# EasyEDA Pro project ProPrj_[LiThermal]热成像相机.epro, schematic V1.2_S1

## Sheets
1 SOC: Board Name: V1.2; Create Date: 2024-09-09; Page Name: SOC; Project Name: [LiThermal] 热成像相机; Schematic Name: V1.2_S1; Update Date: 2024-09-09
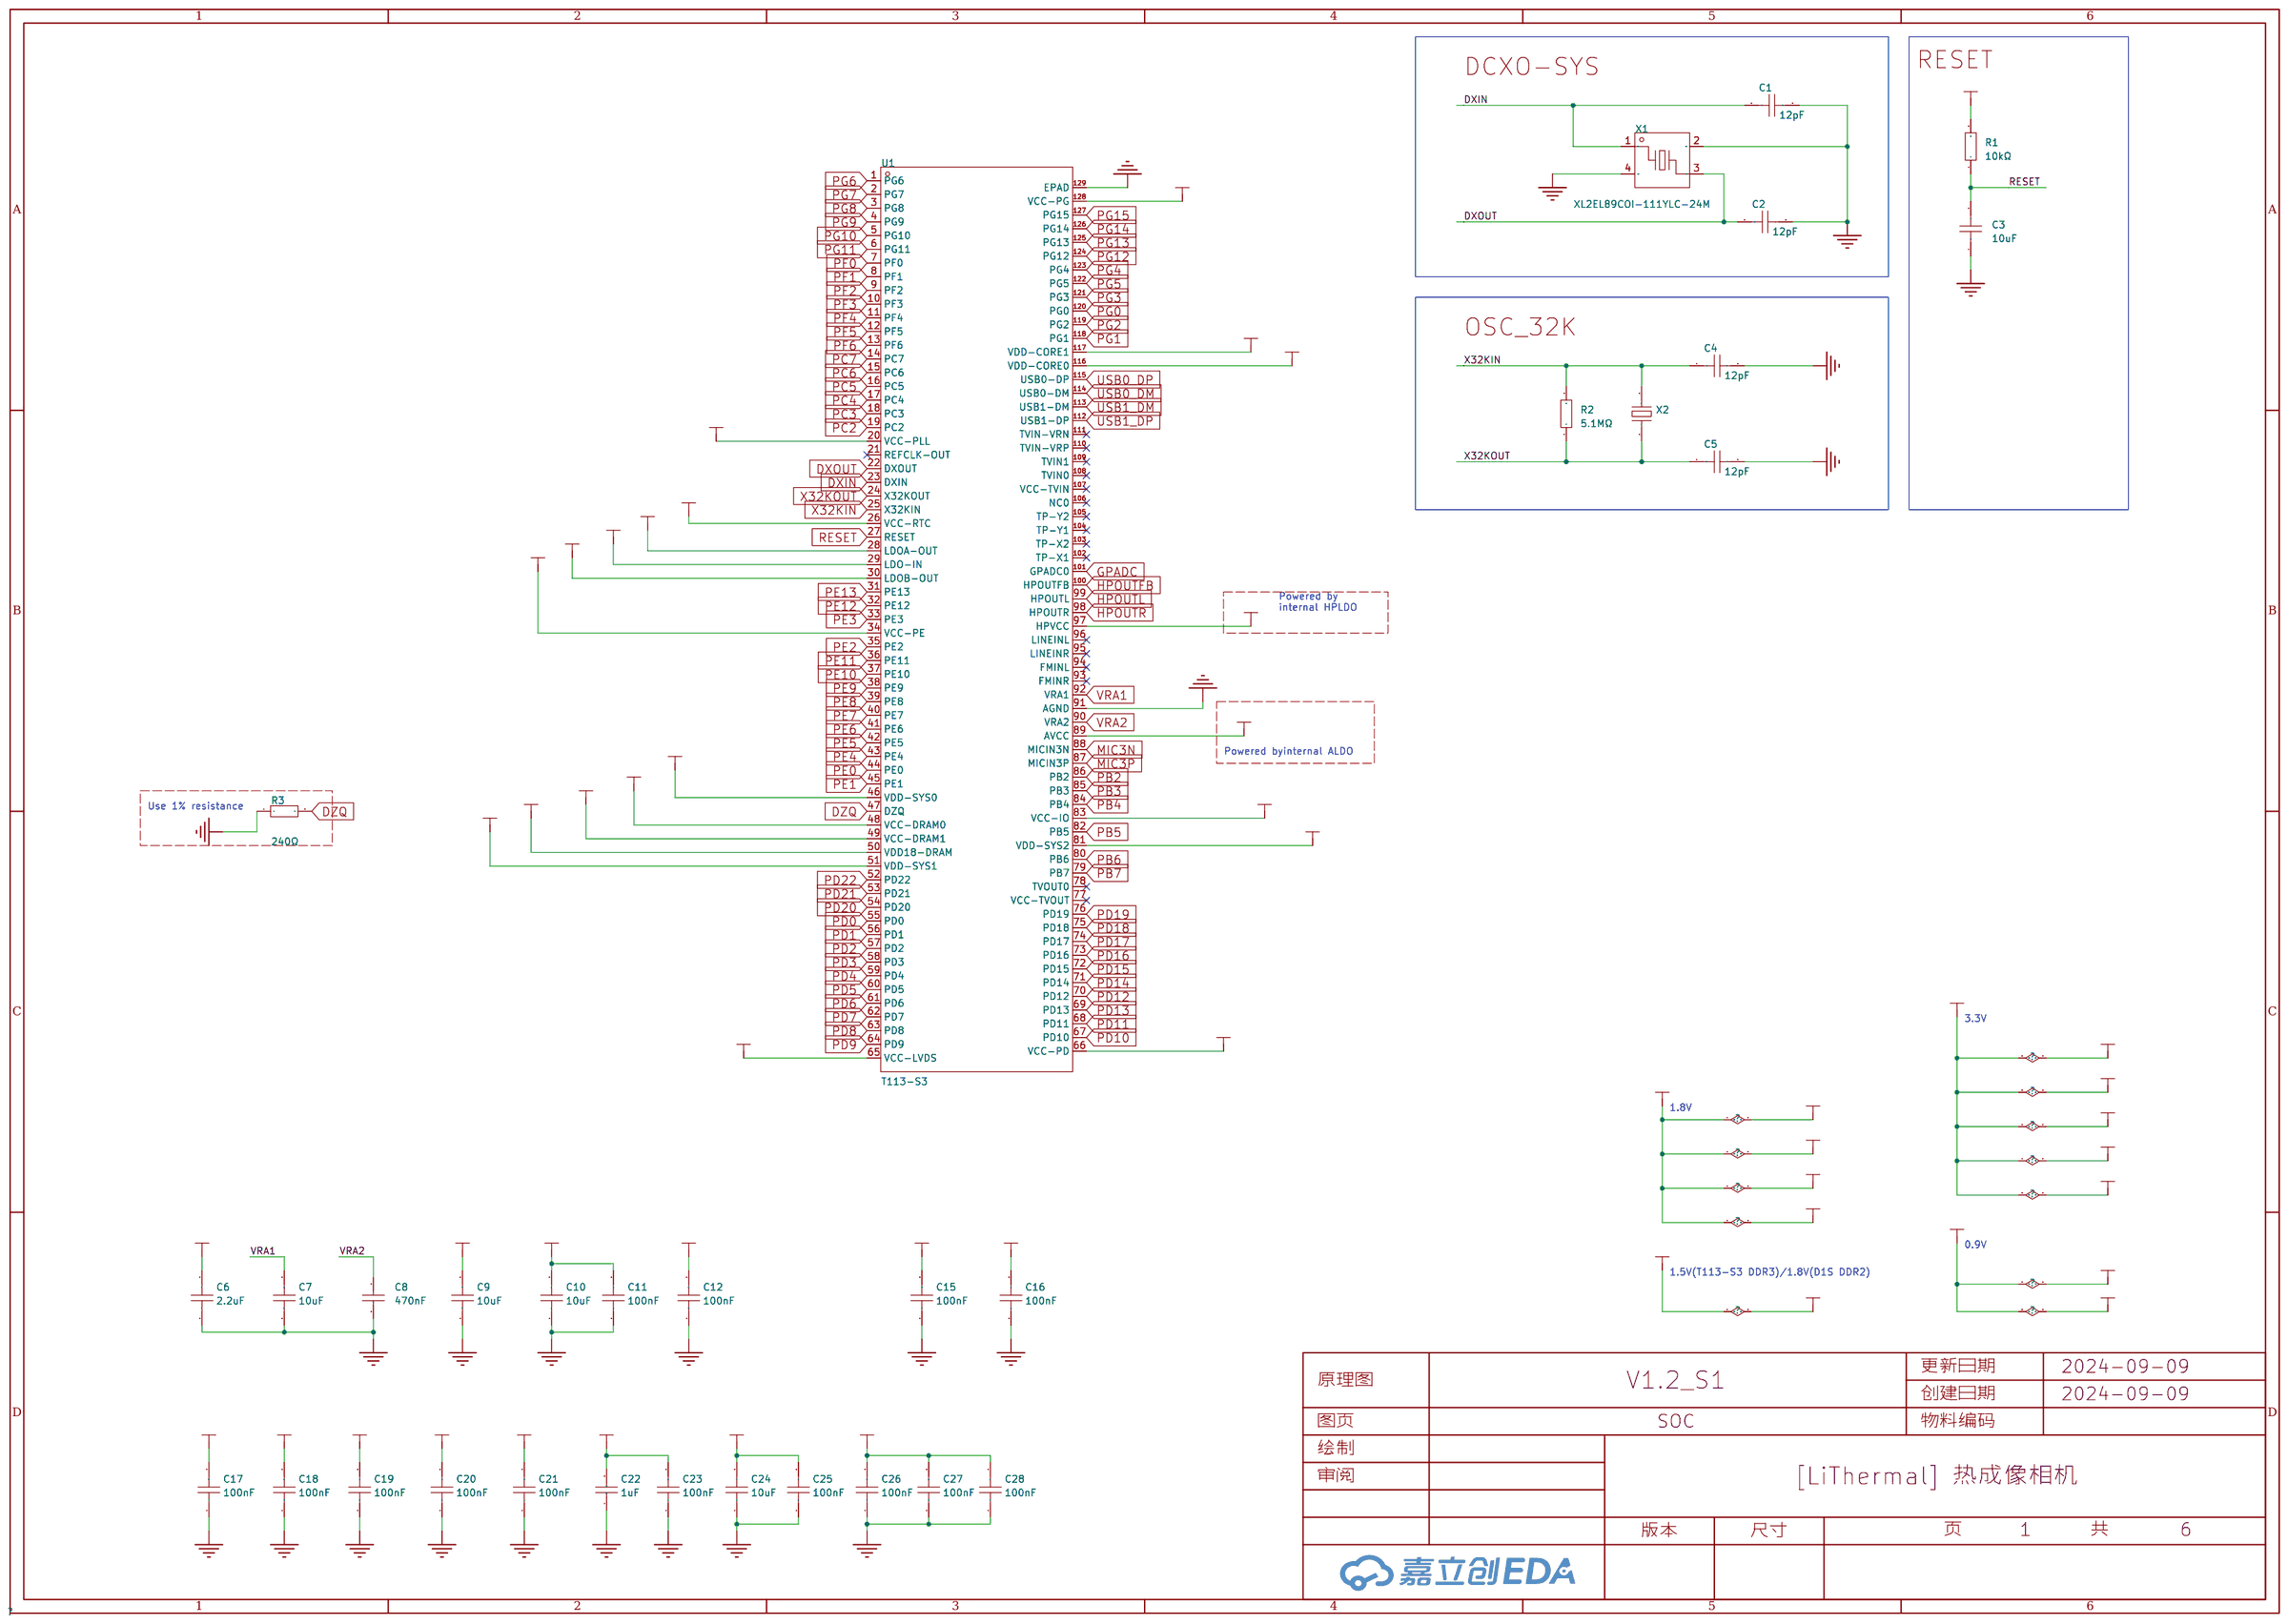
[diagram p0: SOC]
2 Power: Create Date: 2024-08-21; Page Name: Power; Project Name: 全志T113-S3测试板; Update Date: 2024-08-23
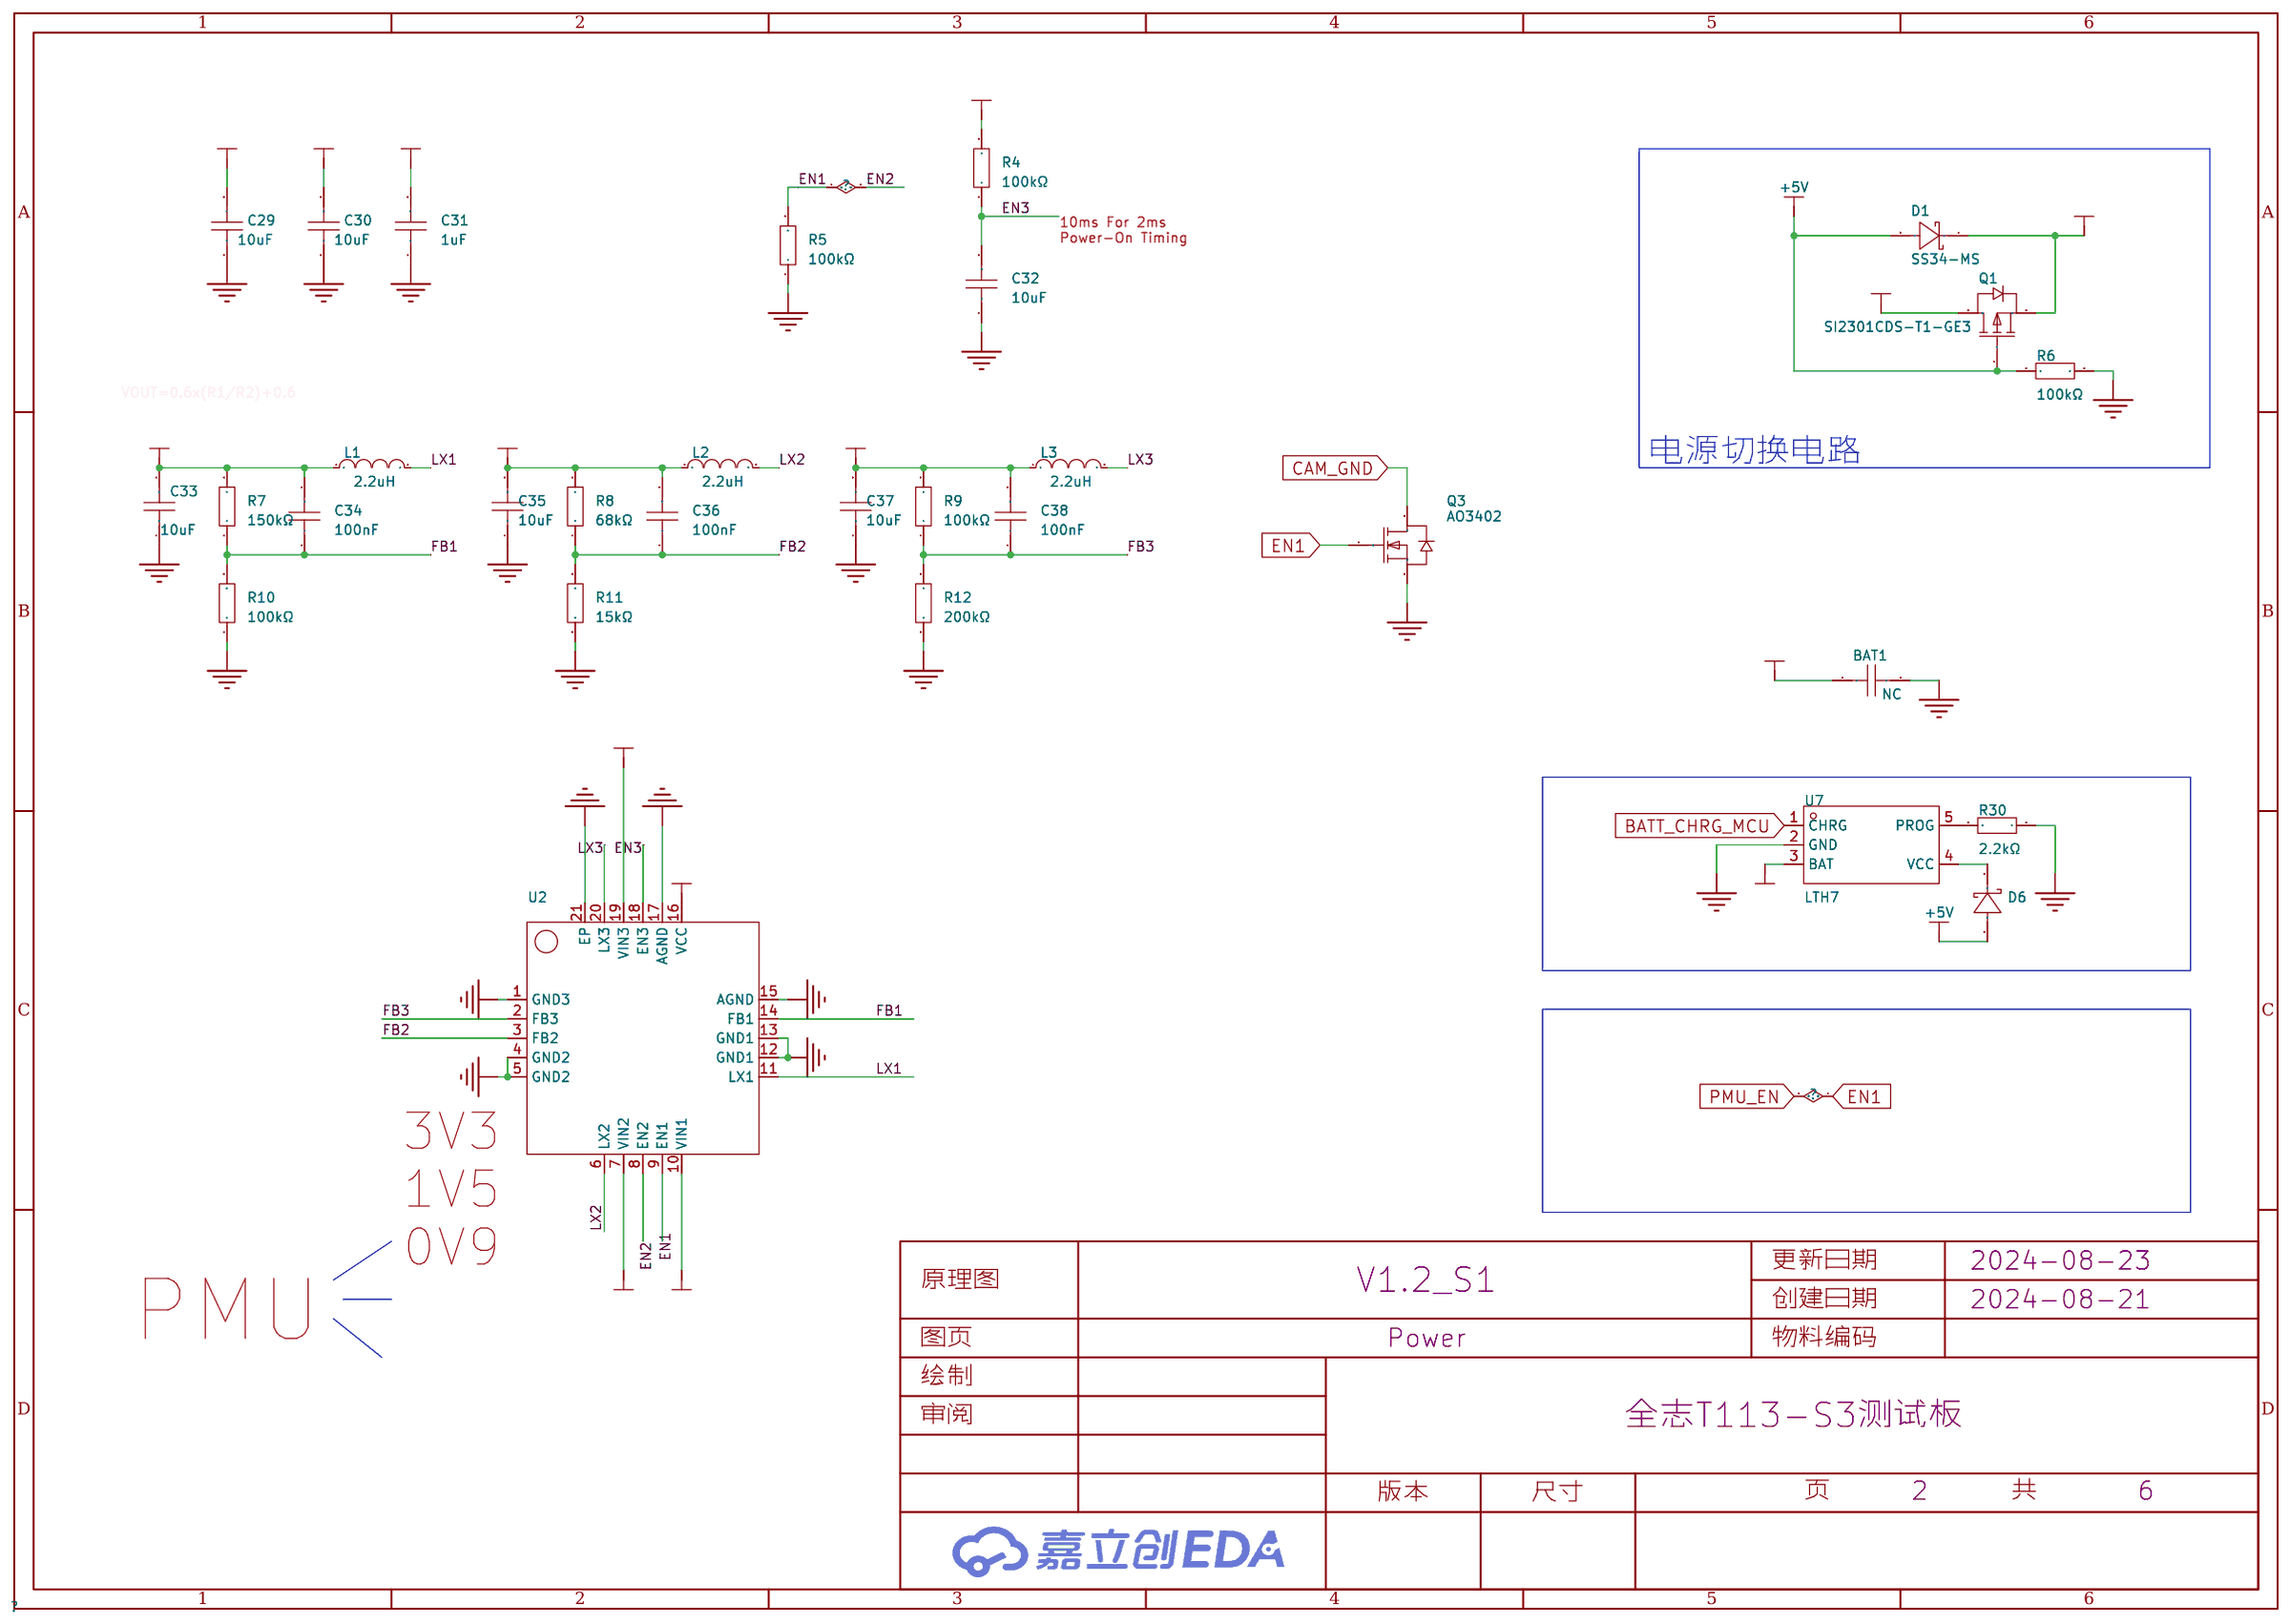
[diagram p1: Power]
3 LCD: Create Date: 2024-06-05; Page Name: LCD; Project Name: 全志T113-S3测试板; Schematic Name: Schematic5; Update Date: 2024-06-06; Company: 嘉立创EDA; Page Size: A4; Version: V1.0
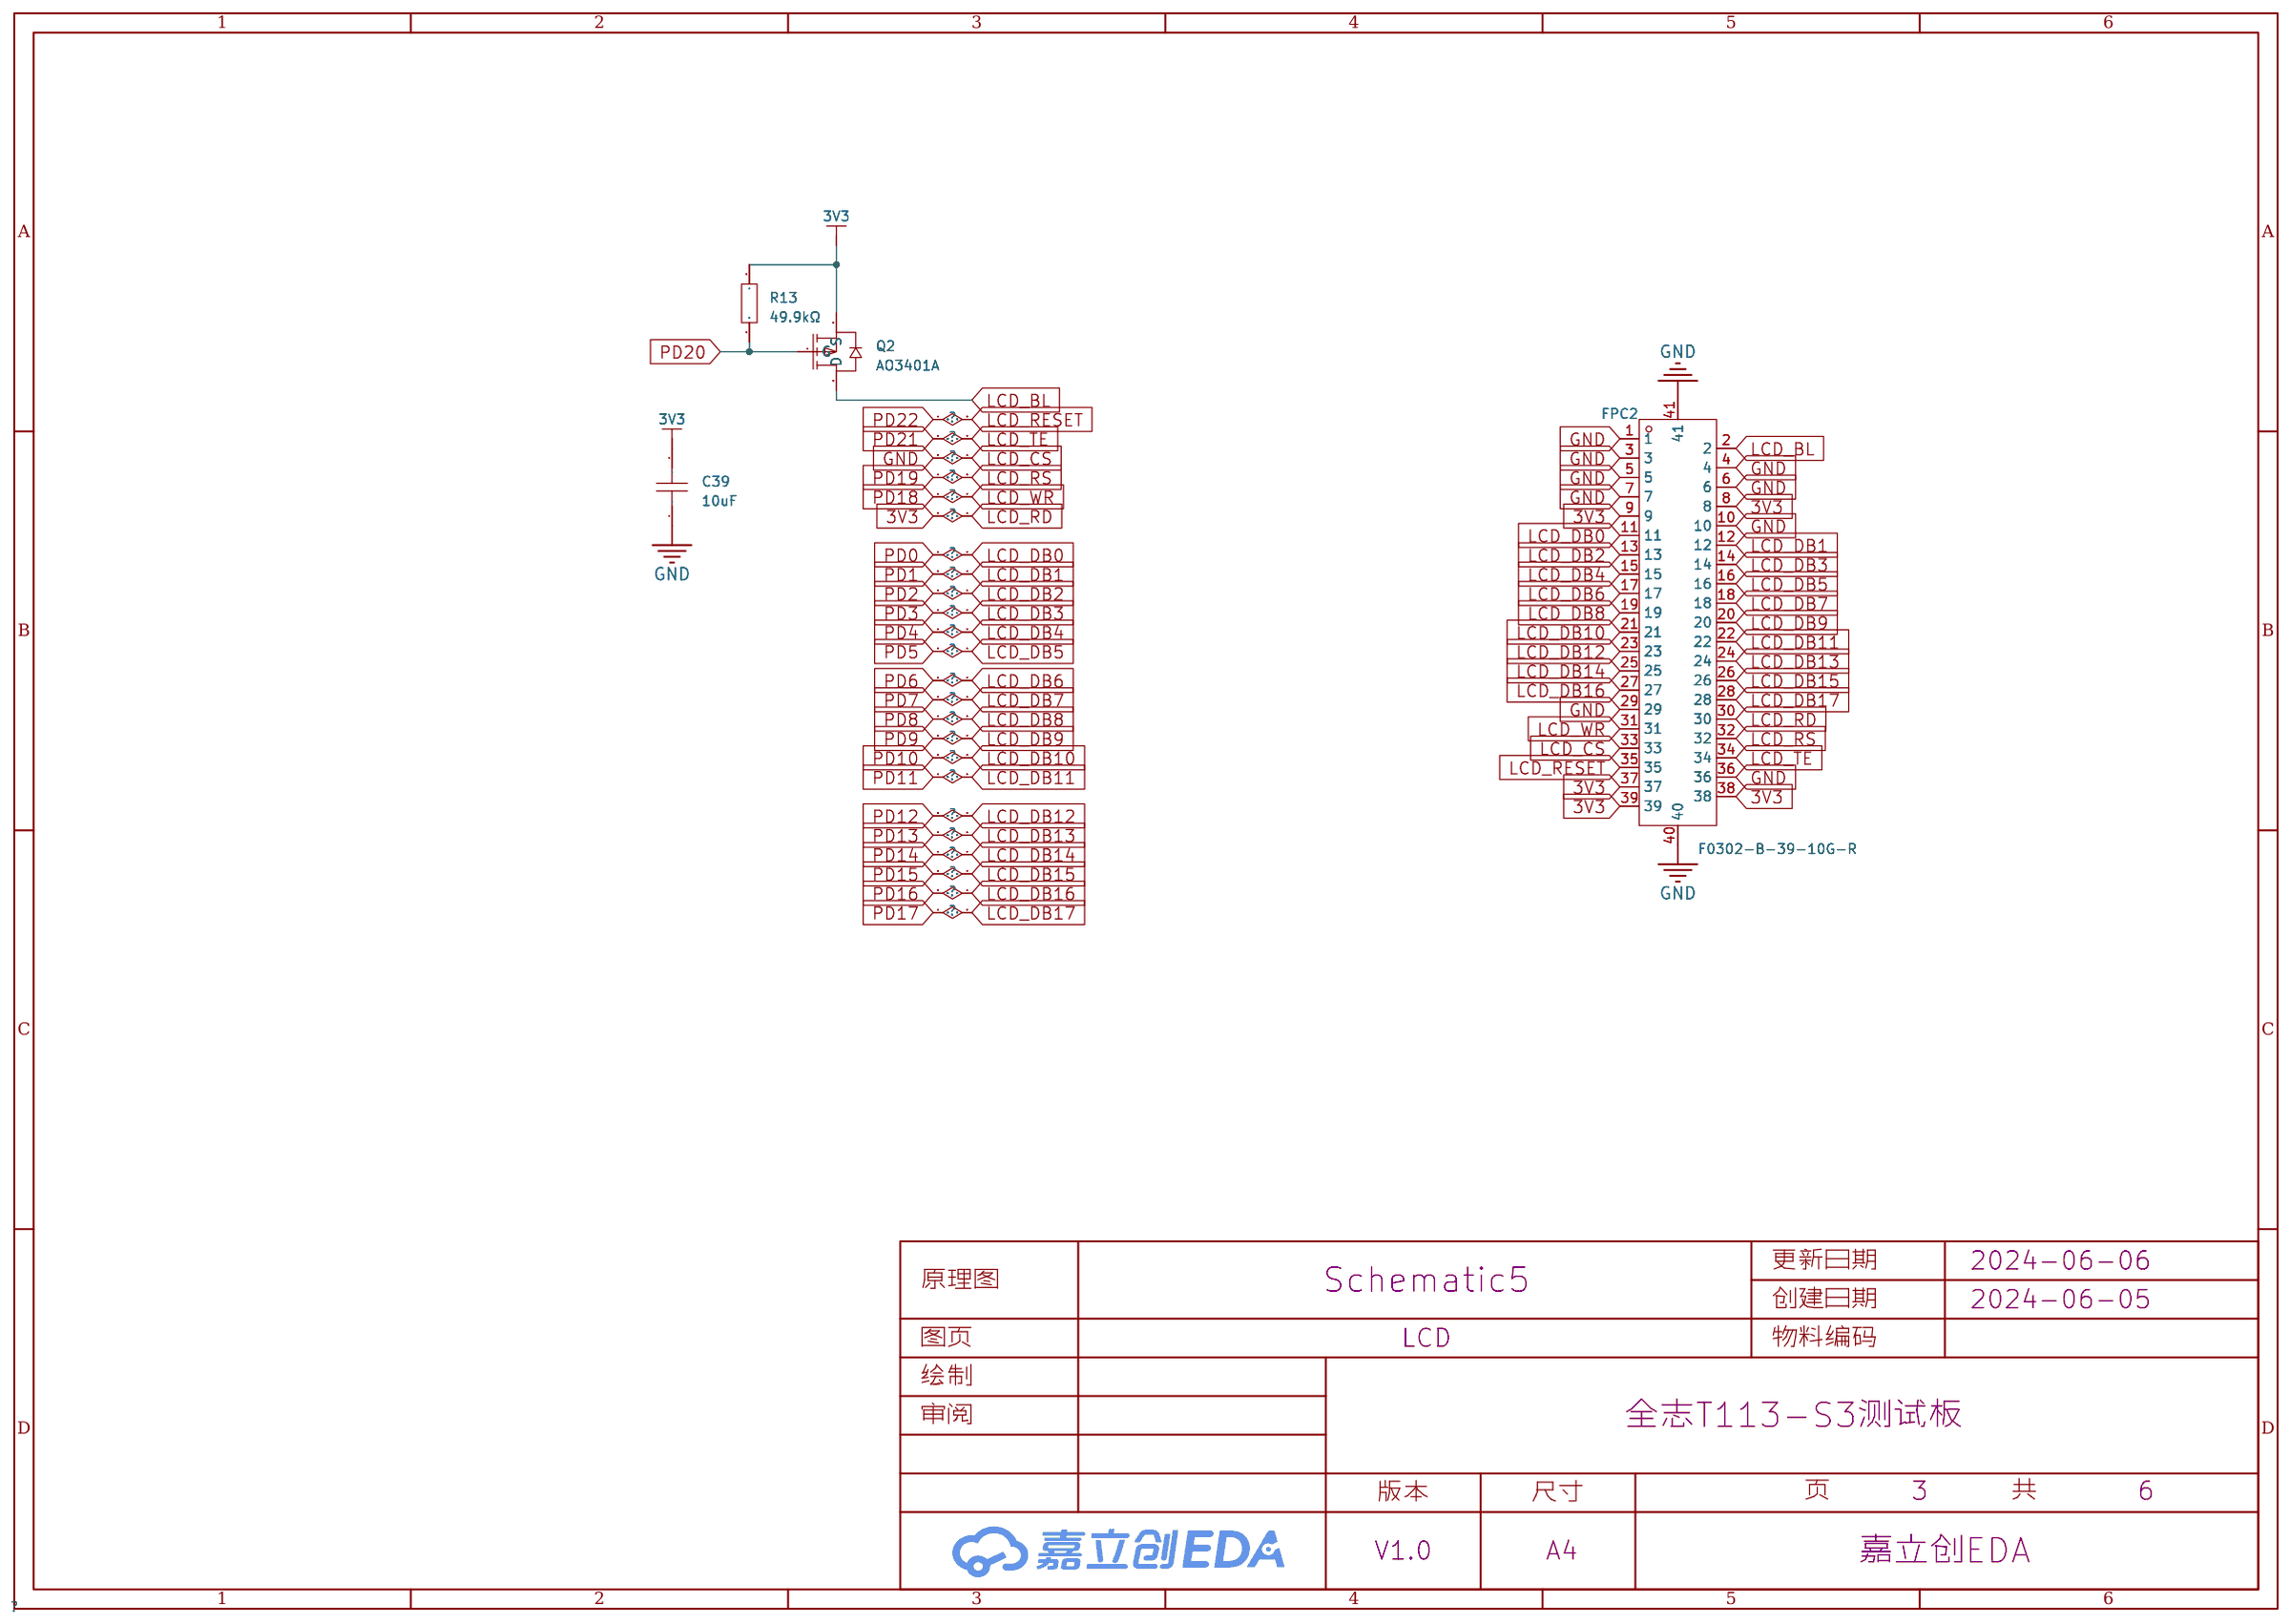
[diagram p2: LCD]
4 Storage: Create Date: 2024-07-25; Page Name: Storage; Project Name: 全志T113-S3测试板; Schematic Name: V1.1_S1; Update Date: 2024-07-25; Company: 嘉立创EDA; Page Size: A4; Version: V1.0
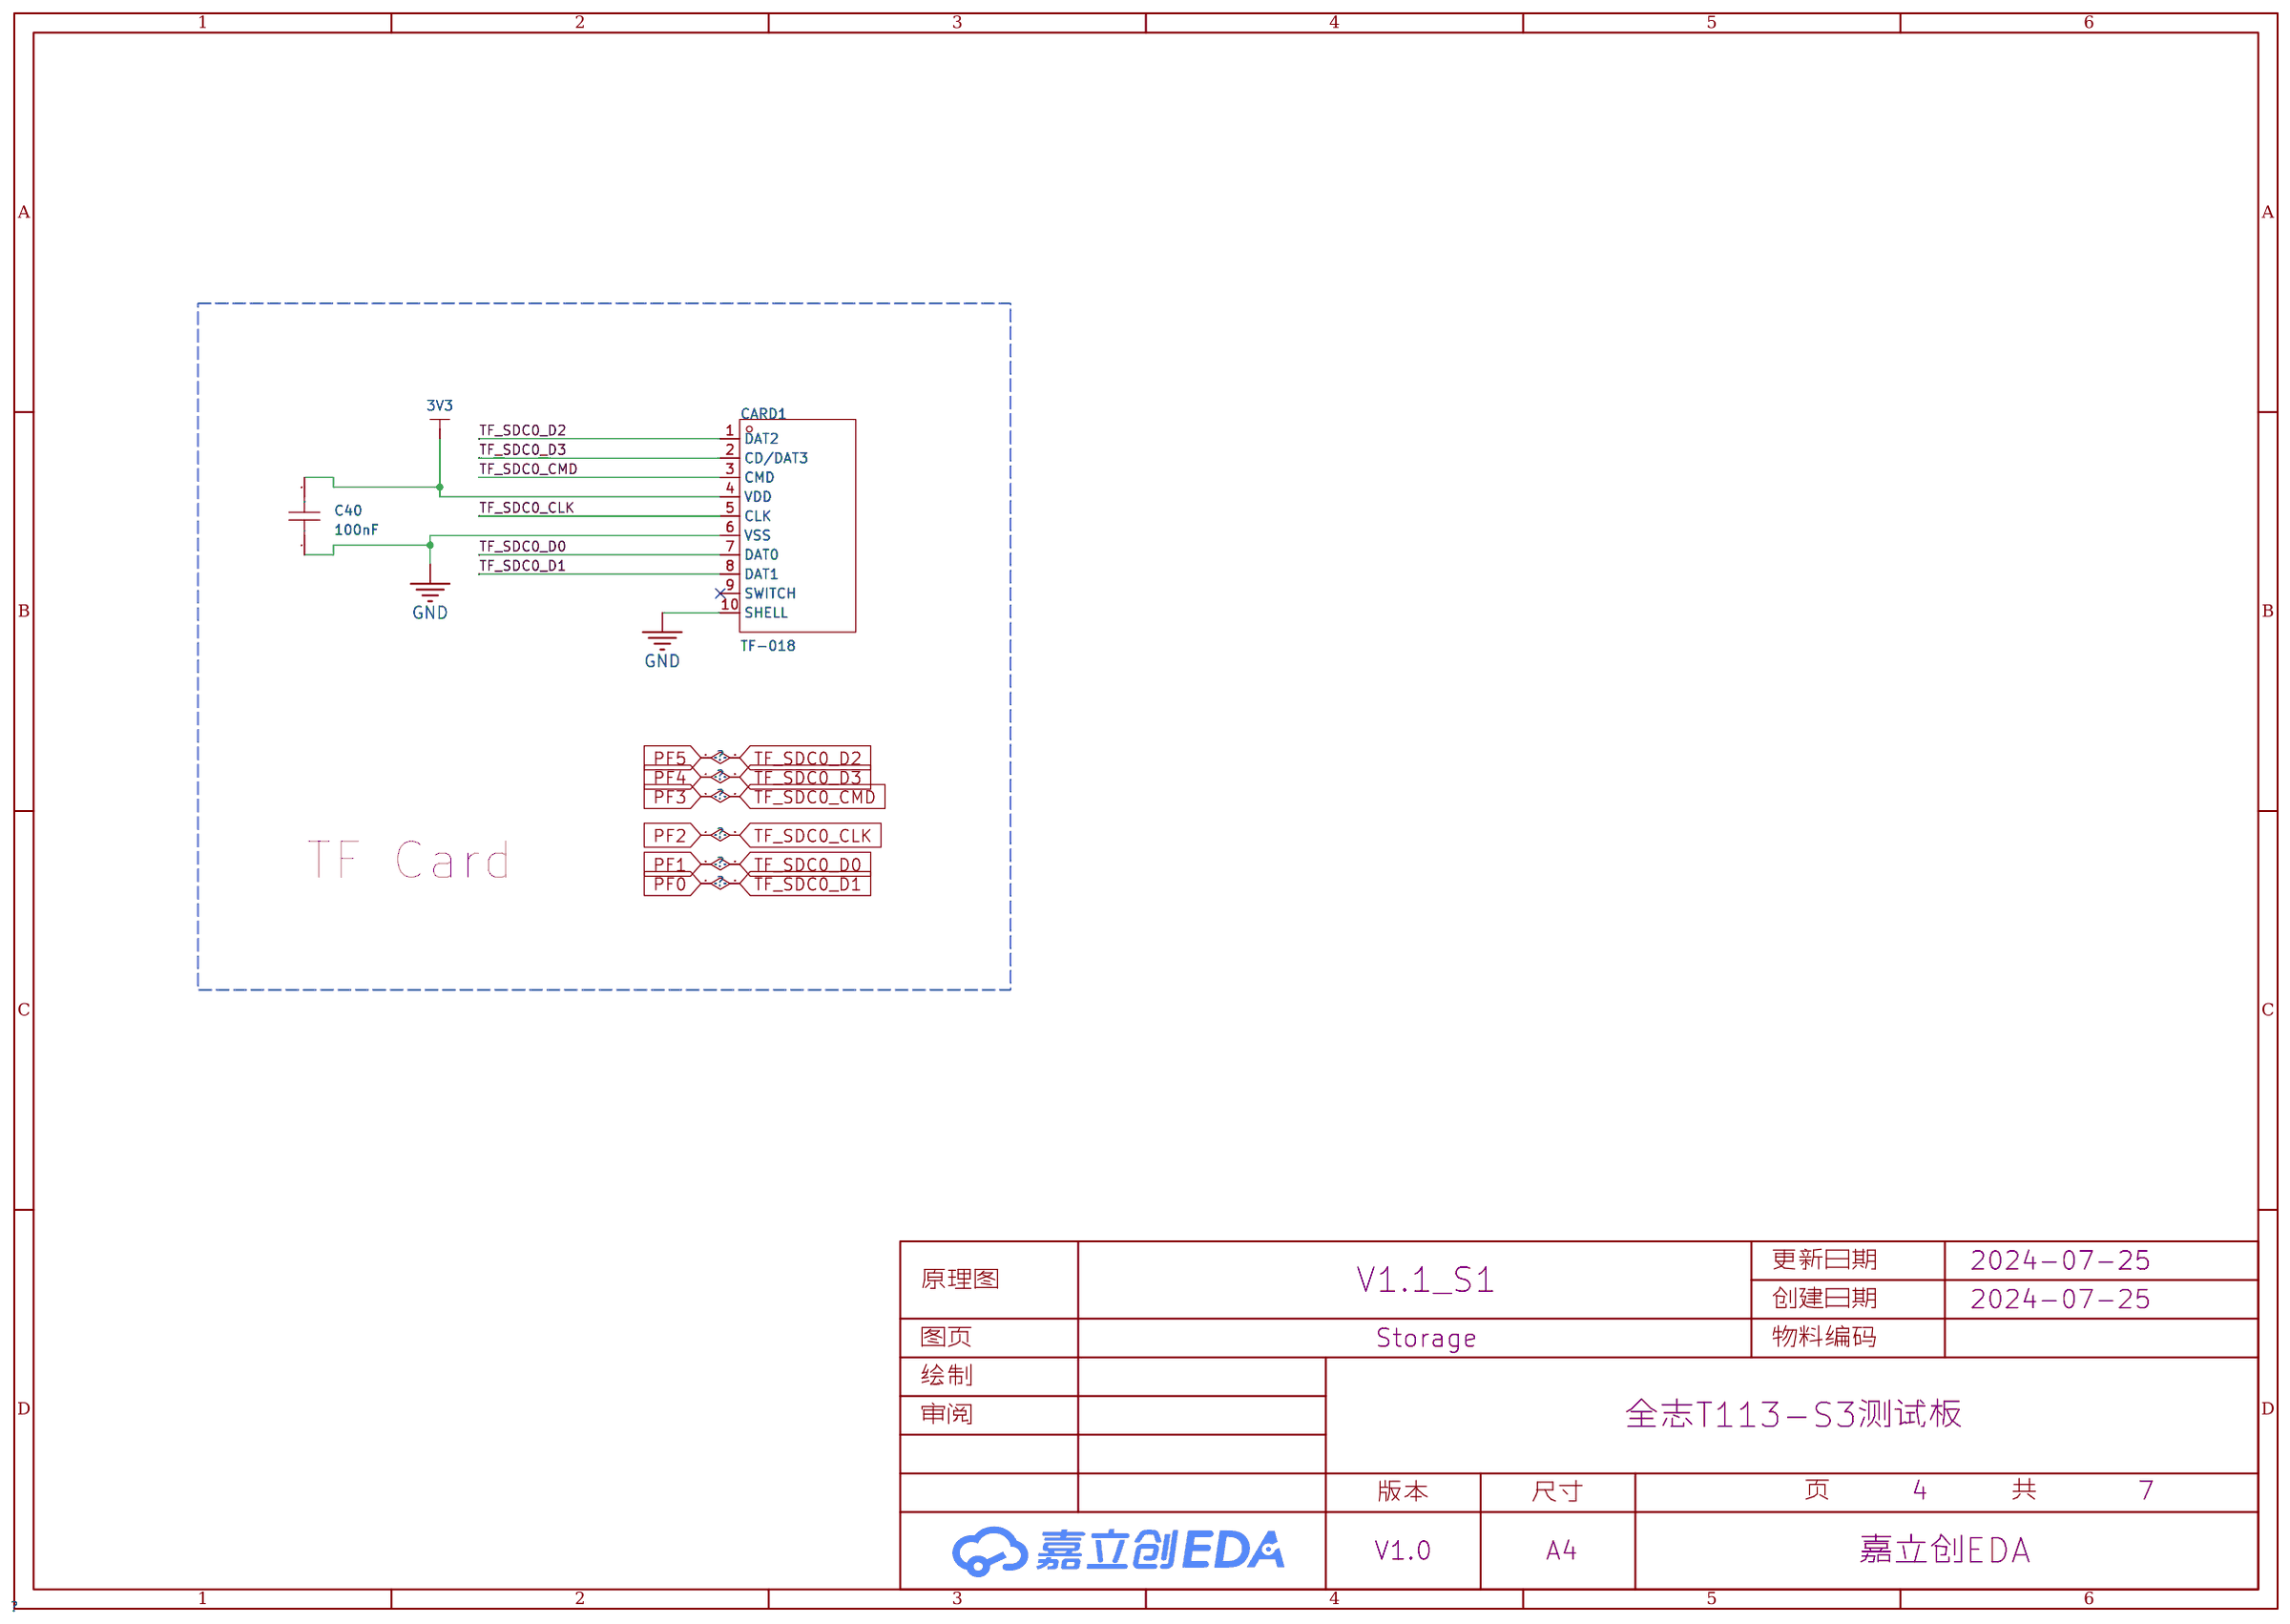
[diagram p3: Storage]
5 USB: Create Date: 2024-08-21; Page Name: USB.V1.2_S1; Project Name: 全志T113-S3测试板; Update Date: 2024-08-21; Company: 嘉立创EDA; Page Size: A4; Version: V1.0
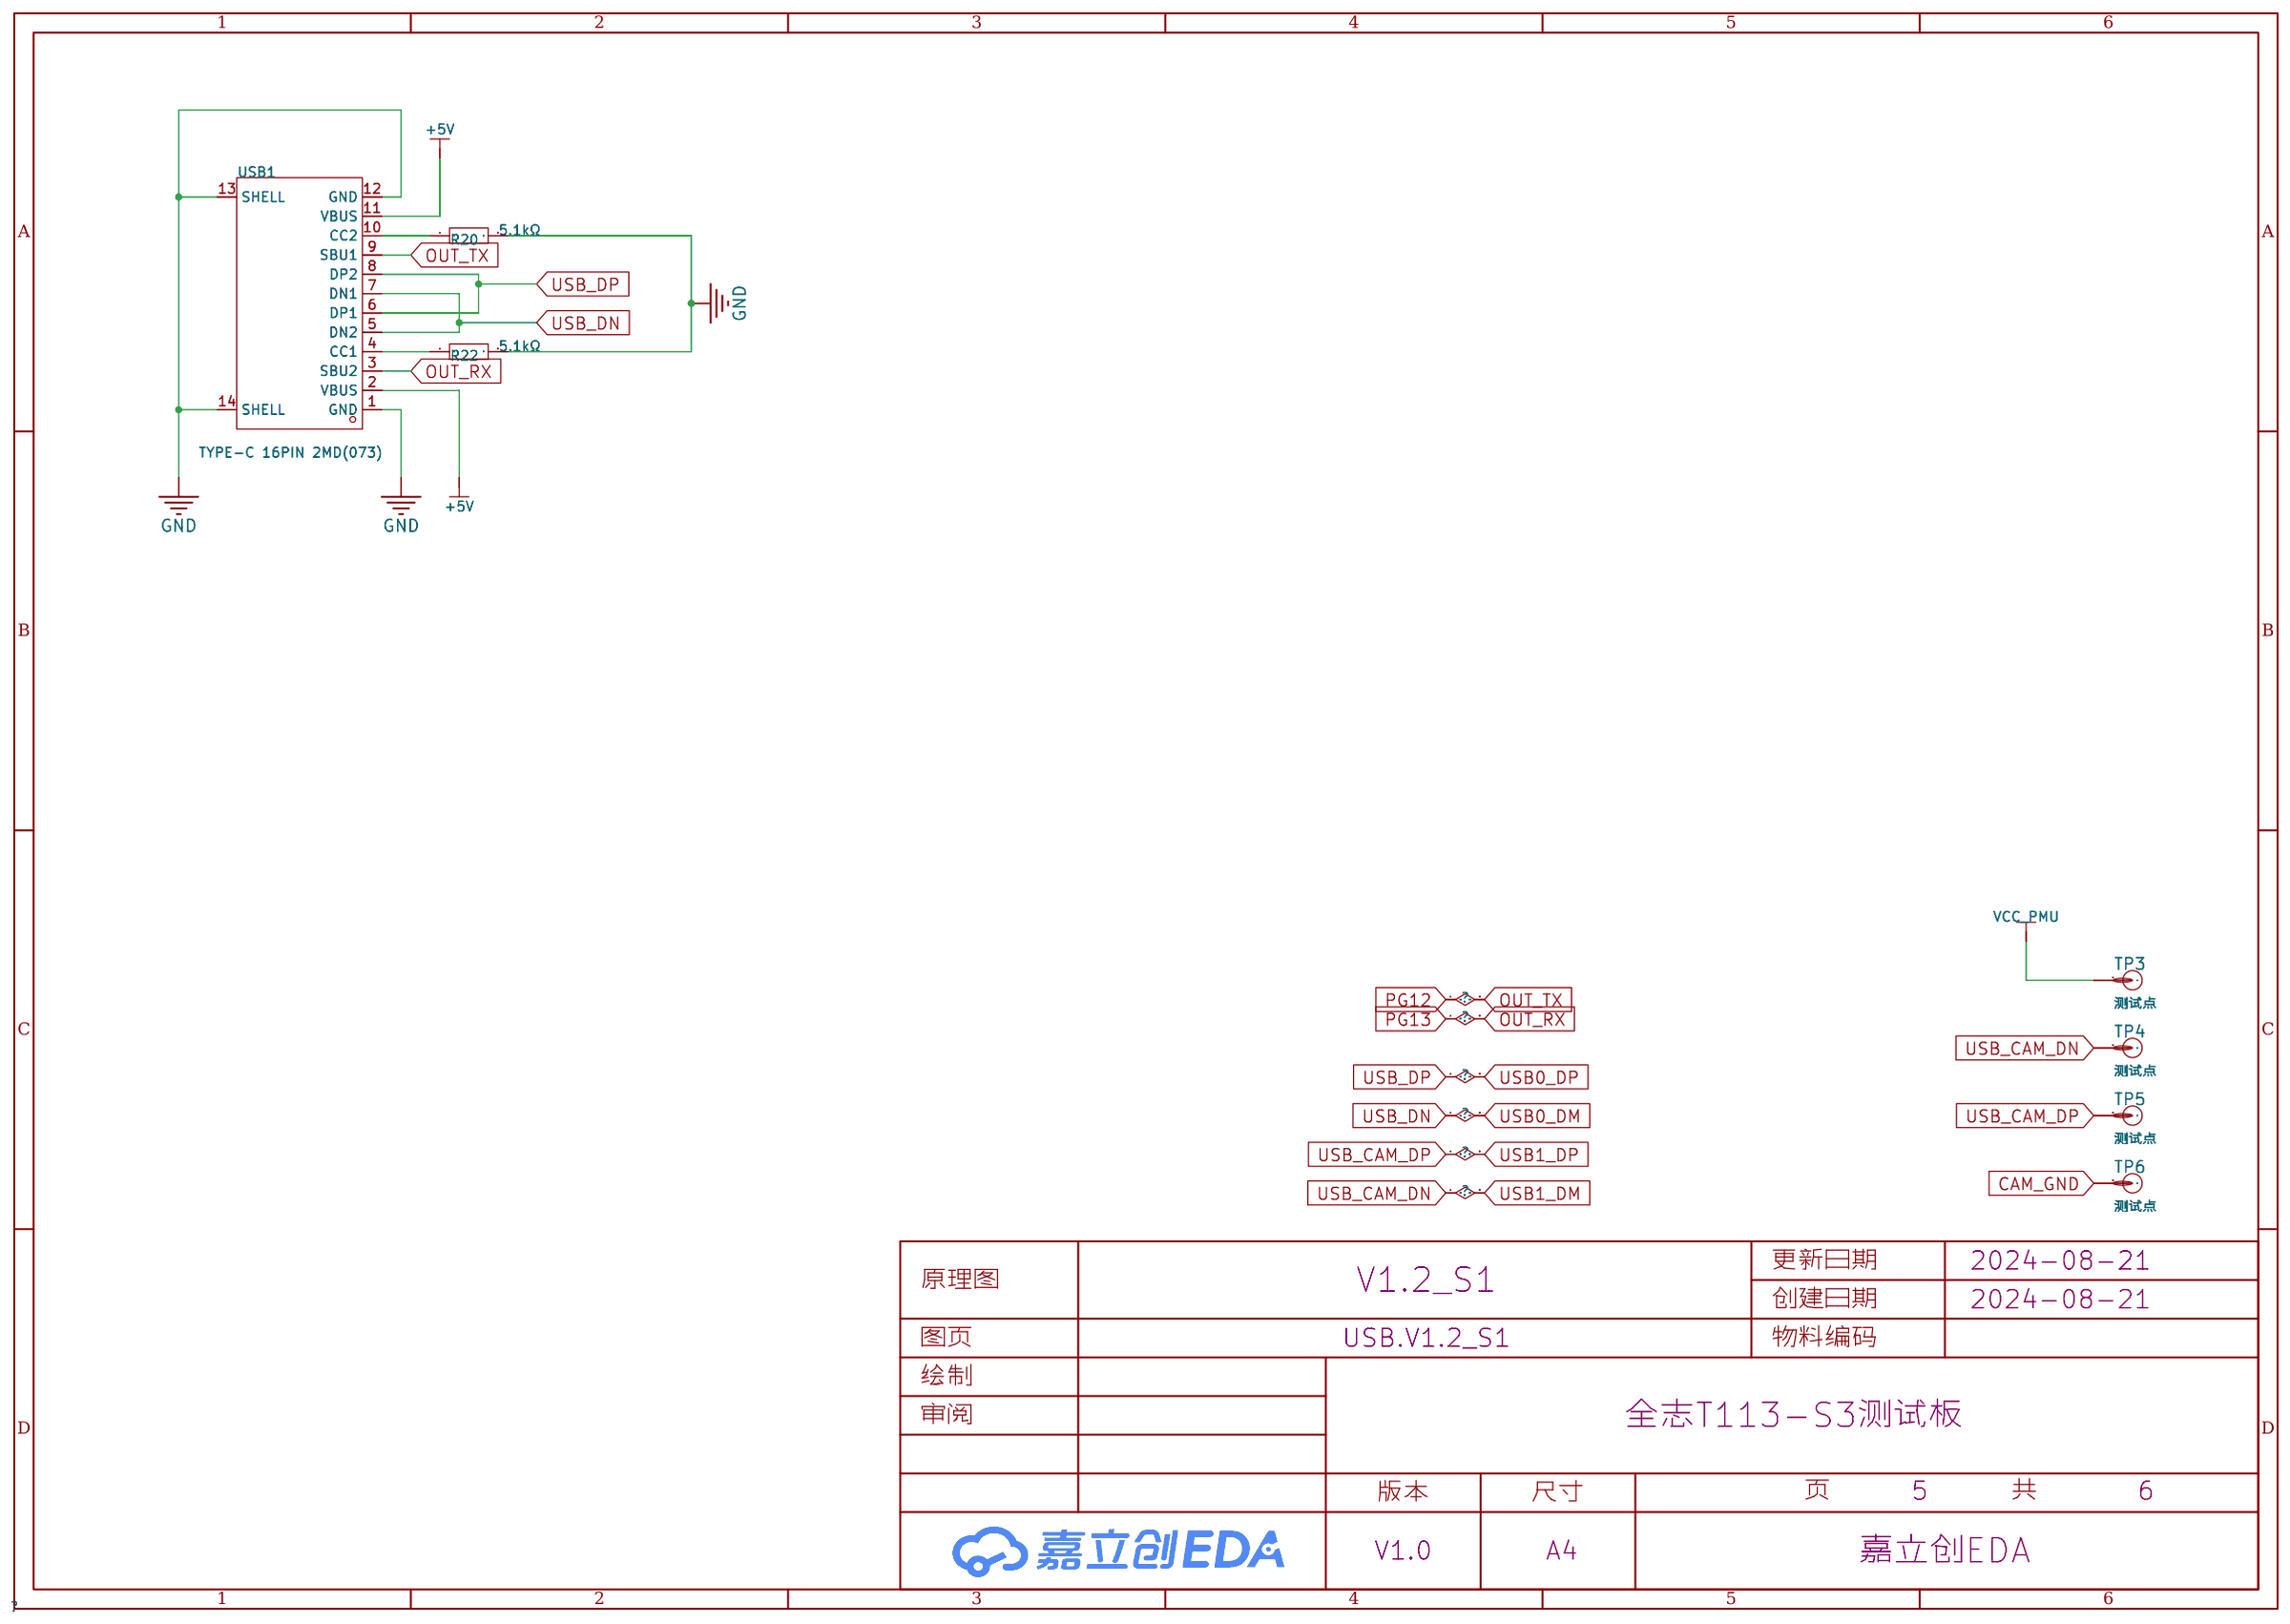
[diagram p4: USB]
6 MCU: Create Date: 2024-08-21; Page Name: MCU; Project Name: 全志T113-S3测试板; Update Date: 2024-08-21
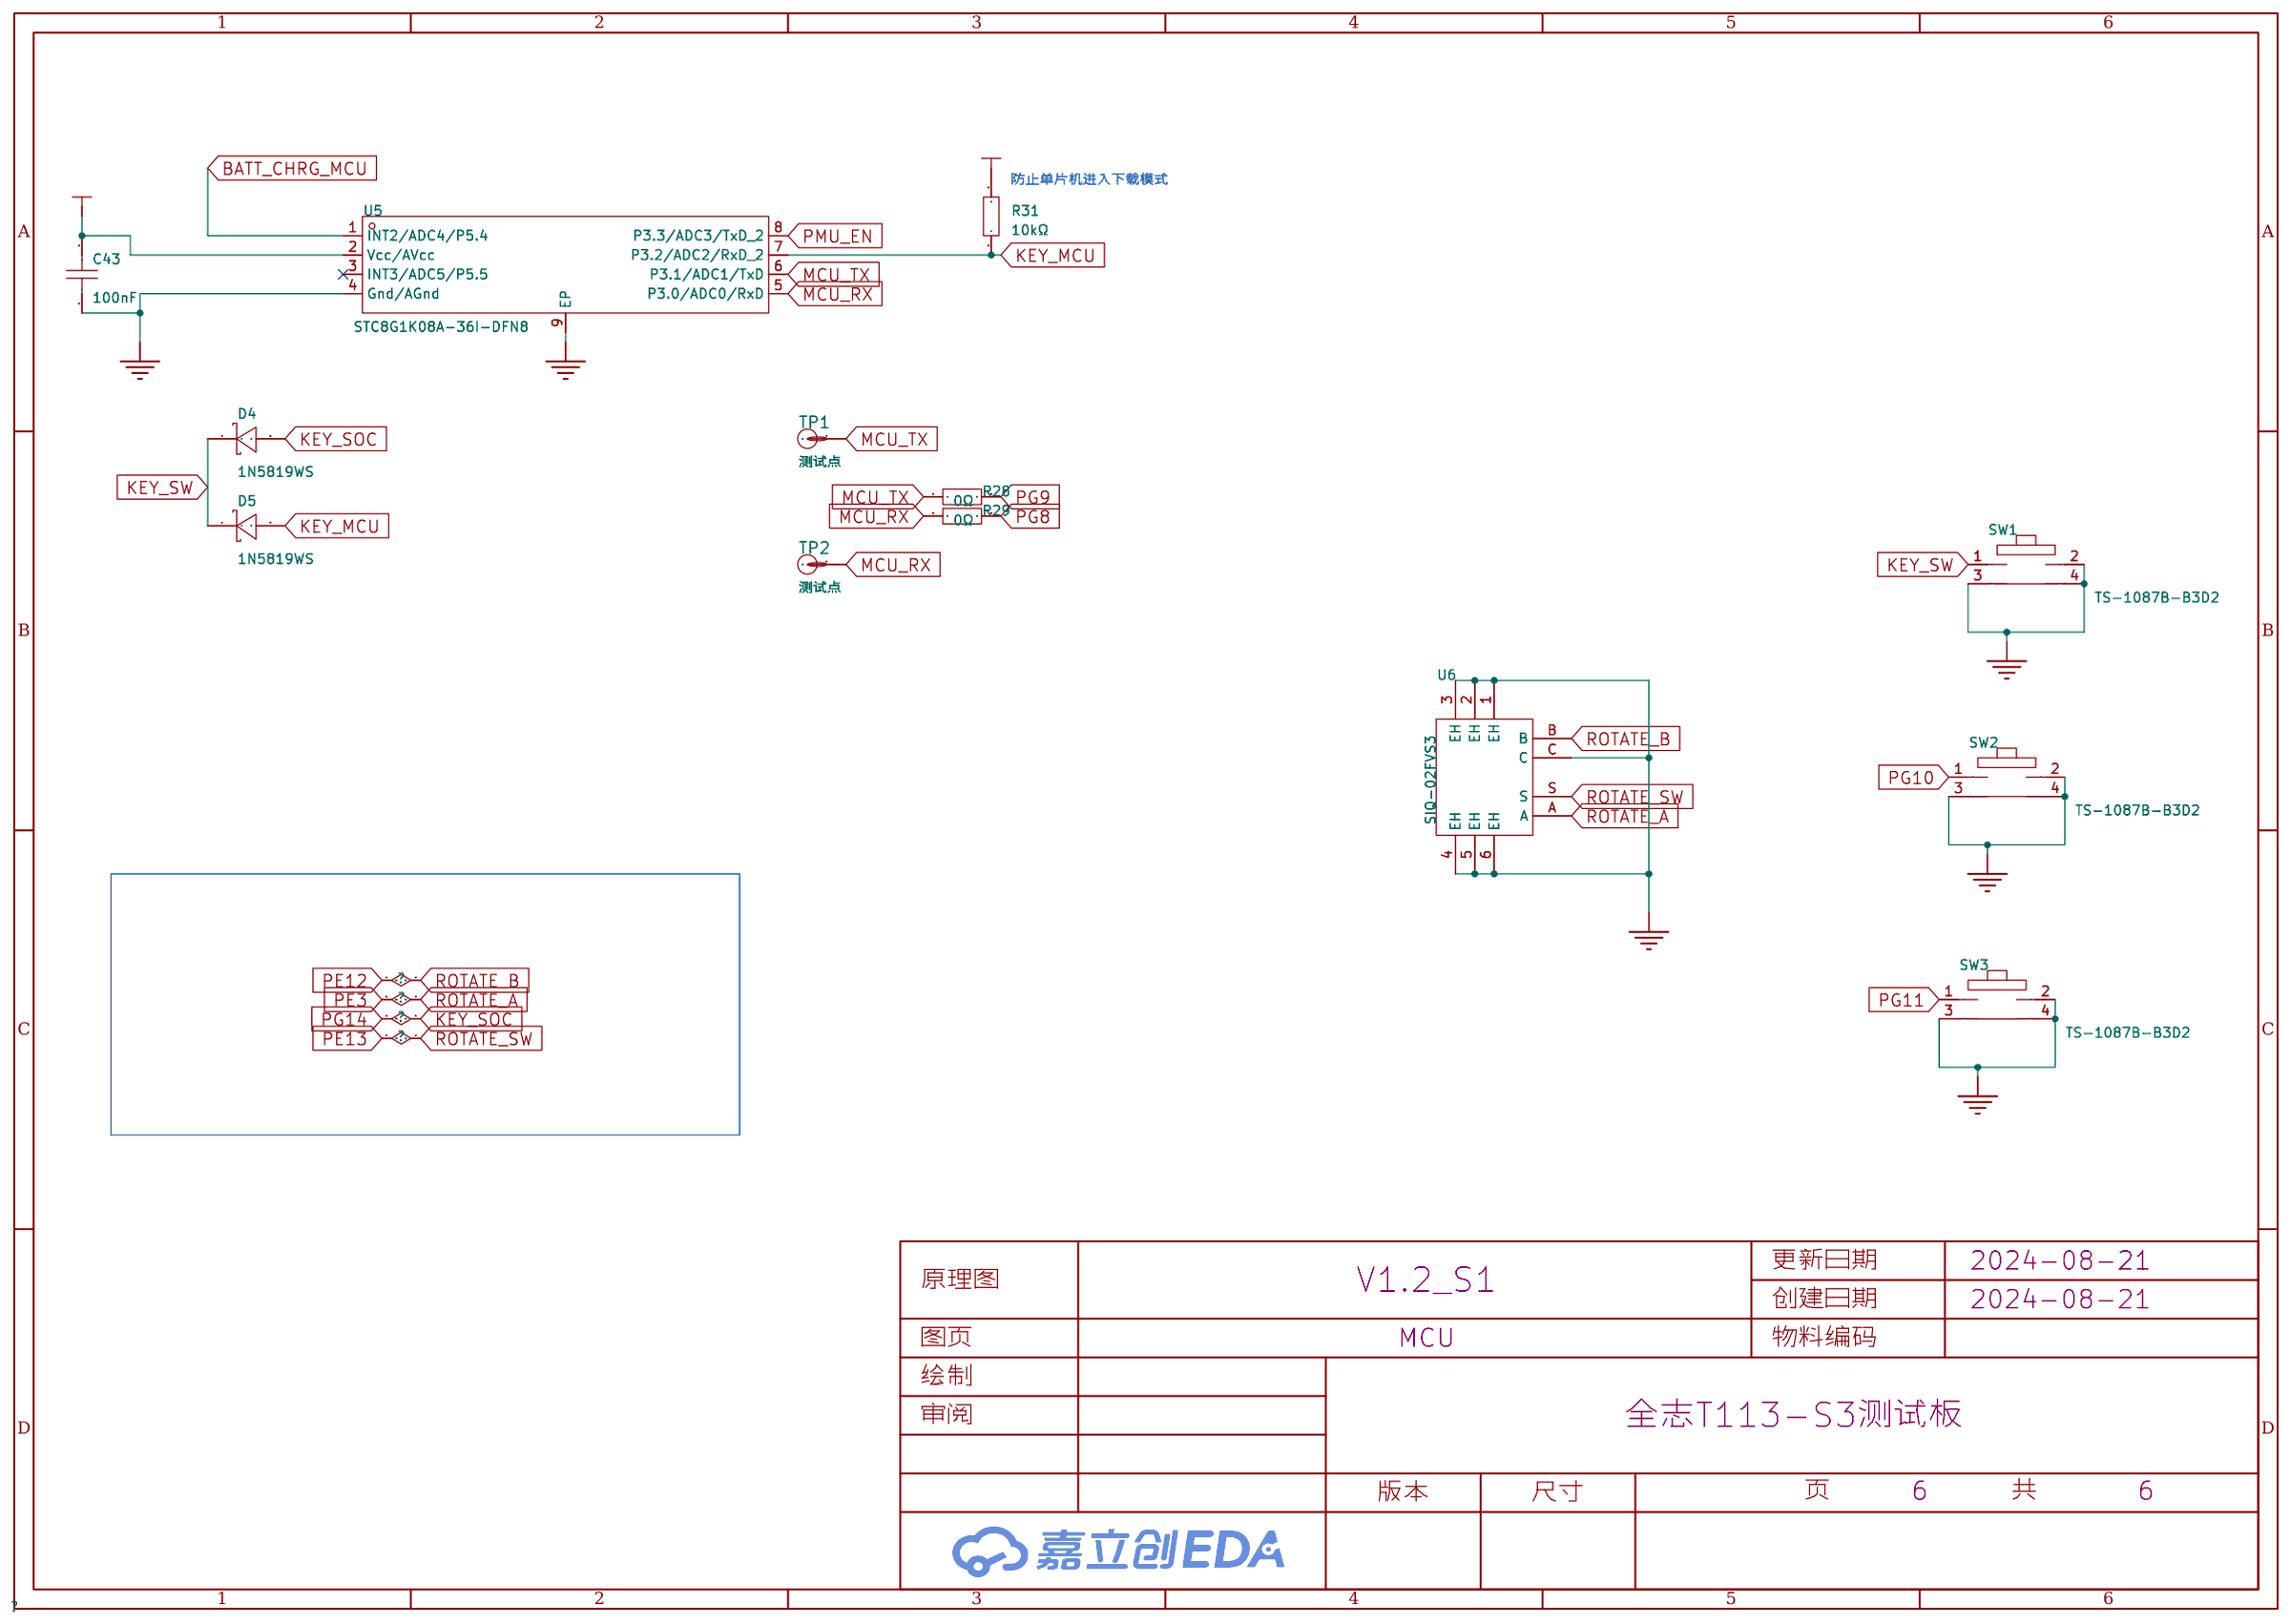
[diagram p5: MCU]

## Parts
sheet LCD
C39  10uF  [C0603]
FPC2  F0302-B-39-10G-R  [FFC-SMD_F0302-B-39-10G-R]
Q2  AO3401A  [SOT-23_L2.9-W1.3-P1.90-LS2.4-BR]
R13  49.9kΩ  [R0402]
sheet MCU
C43  100nF  [C0402]
D4  1N5819WS  [SOD-323_L1.8-W1.3-LS2.5-RD]
D5  1N5819WS  [SOD-323_L1.8-W1.3-LS2.5-RD]
R28  0Ω  [R0603]
R29  0Ω  [R0603]
R31  10kΩ  [R0402]
SW1  TS-1087B-B3D2  [KEY-SMD_4P-L7.8-W2.8-P4.20-EH]
SW2  TS-1087B-B3D2  [KEY-SMD_4P-L7.8-W2.8-P4.20-EH]
SW3  TS-1087B-B3D2  [KEY-SMD_4P-L7.8-W2.8-P4.20-EH]
TP1  网络  [TP-1.5MM]  (no BOM)
TP2  网络  [TP-1.5MM]  (no BOM)
U5  STC8G1K08A-36I-DFN8  [DFN-8_L3.0-W3.0-P0.50-BL-EP]
U6  SIQ-02FVS3  [SW-SMD_SIQ-02FVS3_1]
sheet Power
BAT1  NC  [C0805]
C29  10uF  [C0603]
C30  10uF  [C0603]
C31  1uF  [C0402]
C32  10uF  [C0603]
C33  10uF  [C0603]
C34  100nF  [C0402]
C35  10uF  [C0603]
C36  100nF  [C0402]
C37  10uF  [C0603]
C38  100nF  [C0402]
D1  SS34-MS  [DO-214AC_L4.3-W2.7-LS5.0-RD]
D6  SS34-MS  [DO-214AC_L4.3-W2.7-LS5.0-RD]
L1  2.2uH  [IND-SMD_L2.5-W2.0]
L2  2.2uH  [IND-SMD_L2.5-W2.0]
L3  2.2uH  [IND-SMD_L2.5-W2.0]
Q1  SI2301CDS-T1-GE3  [SOT-23-3_L3.0-W1.7-P0.95-LS2.9-BR]
Q3  AO3402  [SOT-23_L2.9-W1.3-P1.90-LS2.4-BR]
R4  100kΩ  [R0402]
R5  100kΩ  [R0402]
R6  100kΩ  [R0603]
R7  150kΩ  [R0402]
R8  68kΩ  [R0402]
R9  100kΩ  [R0402]
R10  100kΩ  [R0402]
R11  15kΩ  [R0402]
R12  200kΩ  [R0402]
R30  2.2kΩ  [R0603]
U2  EA3036QDR  [QFN-20_L3.0-W3.0-P0.50-BL-EP1.7]
U7  LTH7  [SOT-23-5_L3.0-W1.7-P0.95-LS2.8-BL]
sheet SOC
C1  12pF  [C0402]
C2  12pF  [C0402]
C3  10uF  [C0402]
C4  12pF  [C0402]
C5  12pF  [C0402]
C6  2.2uF  [C0603]
C7  10uF  [C0603]
C8  470nF  [C0603]
C9  10uF  [C0603]
C10  10uF  [C0603]
C11  100nF  [C0402]
C12  100nF  [C0402]
C15  100nF  [C0402]
C16  100nF  [C0402]
C17  100nF  [C0402]
C18  100nF  [C0402]
C19  100nF  [C0402]
C20  100nF  [C0402]
C21  100nF  [C0402]
C22  1uF  [C0402]
C23  100nF  [C0402]
C24  10uF  [C0603]
C25  100nF  [C0402]
C26  100nF  [C0402]
C27  100nF  [C0402]
C28  100nF  [C0402]
R1  10kΩ  [R0402]
R2  5.1MΩ  [R0402]
R3  240Ω  [R0603]
U1  T113-S3  [LQFP-128_L14.0-W14.0-P0.40-LS16.0-BL-EP5.6]
X1  XL2EL89COI-111YLC-24M  [CRYSTAL-SMD_4P-L3.2-W2.5-BL]
X2  32.768kHz  [OSC-SMD_L3.2-W1.5]
sheet Storage
C40  100nF  [C0402]
CARD1  TF-018  [TF-SMD_TF-018]
sheet USB
R20  5.1kΩ  [R0402]
R22  5.1kΩ  [R0402]
TP3  网络  [TP-1.5MM]  (no BOM)
TP4  网络  [TP-1.5MM]  (no BOM)
TP5  网络  [TP-1.5MM]  (no BOM)
TP6  网络  [TP-1.5MM]  (no BOM)
USB1  TYPE-C 16PIN 2MD(073)  [USB-C-SMD_TYPE-C-6PIN-2MD-073]

## Library data of the parts
C29 C30 C32 C33 C35 C37 C39 = CL10A106KP8NNNC: 容值:10uF;精度:±10%;额定电压:10V;材质(温度系数):X5R;; LCSC Part Name: 10uF ±10% 10V; Supplier Part: C19702; Manufacturer: SAMSUNG(三星); Supplier Footprint: 0603; JLCPCB Part Class: Basic Part; Datasheet: https://atta.szlcsc.com/upload/public/pdf/source/20160218/1457707763339.pdf; Supplier: LCSC; Tolerance: ±10%; Voltage Rated: 10V; Temperature Coefficient: X5R
FPC2 = F0302-B-39-10G-R: 锁定特性:翻盖式;触点类型:下接;触点数量:39P;间距:0.3mm;安装类型:卧贴;工作温度范围:-55℃~+85℃;; LCSC Part Name: 间距:0.3mm P数:39P 翻盖式 下接; Supplier Part: C1884507; Manufacturer: XFCN(兴飞); Supplier Footprint: SMD,P=0.3mm,卧贴; JLCPCB Part Class: 扩展库; Datasheet: https://atta.szlcsc.com/upload/public/pdf/source/20210108/C1884507_69ED8BE6A4726BEBDF91913B9F5CC735.pdf; Supplier: LCSC; Locking Feature: 翻盖式; Contact Type: 下接; Number of Contacts: 39P; Pitch: 0.3mm; Mounting Type: 卧贴; FFC, FCB Thickness: 0.2mm; Height Above Board: 1mm; Operating Temperature Range: -55℃~+85℃
Q2 = AO3401A_C15127: 类型:1个P沟道;漏源电压(Vdss):30V;连续漏极电流(Id):4A;功率(Pd):1.4W;导通电阻(RDS(on)@Vgs,Id):44mΩ@10V,4.3A;阈值电压(Vgs(th)@Id):1.3V@250uA;; LCSC Part Name: 1个P沟道 耐压:30V 电流:4A; Supplier Part: C15127; Manufacturer: AOS; Supplier Footprint: SOT-23; JLCPCB Part Class: Basic Part; Datasheet: https://atta.szlcsc.com/upload/public/pdf/source/20160507/1462613609053.pdf; Supplier: LCSC; Type: 1个P沟道; Drain Source Voltage (Vdss): 30V; Continuous Drain Current (Id): 4A; Power Dissipation (Pd): 1.4W; Drain Source On Resistance (RDS(on)@Vgs,Id): 44mΩ@10V,4.3A; Gate Threshold Voltage (Vgs(th)@Id): 1.3V@250uA; Total Gate Charge (Qg@Vgs): 12.2nC@4.5V; Input Capacitance (Ciss@Vds): 1.2nF@15V; Operating Temperature: -55℃~+150℃@(Tj)
R13 = 0402WGF4992TCE: 电阻类型:厚膜电阻;阻值:49.9kΩ;精度:±1%;功率:62.5mW;最大工作电压:50V;温度系数:±100ppm/℃;; LCSC Part Name: 49.9kΩ ±1% 62.5mW 厚膜电阻; Supplier Part: C25897; Manufacturer: UNI-ROYAL(厚声); Supplier Footprint: 0402; JLCPCB Part Class: Extended Part; Datasheet: https://atta.szlcsc.com/upload/public/pdf/source/20200306/C422600_1E6D84923E4A46A82E41ADD87F860B5C.pdf; Supplier: LCSC; Type: 厚膜电阻; Tolerance: ±1%; Power(Watts): 62.5mW; Overload Voltage (Max): 50V; Temperature Coefficient: ±100ppm/℃; Operating Temperature Range: -55℃~+155℃
C11 C12 C15-C21 C23 C25-C28 C34 C36 C38 C40 C43 = CL05B104KB54PNC: 容值:100nF;精度:±10%;额定电压:50V;材质(温度系数):X7R;; LCSC Part Name: 100nF ±10% 50V; Supplier Part: C307331; Manufacturer: SAMSUNG(三星); Supplier Footprint: 0402; JLCPCB Part Class: Basic Part; Datasheet: https://atta.szlcsc.com/upload/public/pdf/source/20160218/1457707763339.pdf; Supplier: LCSC; Tolerance: ±10%; Voltage Rated: 50V; Temperature Coefficient: X7R
D4 D5 = 1N5819WS_C191023: 正向压降(Vf):600mV@1A;直流反向耐压(Vr):40V;平均整流电流(Io):1A;; LCSC Part Name: 电压:40V 电流:1A; Supplier Part: C191023; Manufacturer: Hottech(合科泰); Supplier Footprint: SOD-323; JLCPCB Part Class: 基础库; Datasheet: https://atta.szlcsc.com/upload/public/pdf/source/20220428/3CB86FD8D28D653594B4E35F9D5AEFD9.pdf; Supplier: LCSC; Forward Voltage (Vf@If): 600mV@1A; Reverse Voltage (Vr): 40V; Average Rectified Current (Io): 1A
R28 R29 = 0603WAF0000T5E: 电阻类型:厚膜电阻;阻值:0Ω;精度:±1%;功率:100mW;最大工作电压:75V;; LCSC Part Name: 0Ω ±1% 100mW 厚膜电阻; Supplier Part: C21189; Manufacturer: UNI-ROYAL(厚声); Supplier Footprint: 0603; JLCPCB Part Class: Basic Part; Datasheet: https://atta.szlcsc.com/upload/public/pdf/source/20200306/C422600_1E6D84923E4A46A82E41ADD87F860B5C.pdf; Supplier: LCSC; Type: 厚膜电阻; Tolerance: ±1%; Power(Watts): 100mW; Overload Voltage (Max): 75V; Operating Temperature Range: -55℃~+155℃
R1 R31 = 0402WGF1002TCE: 电阻类型:厚膜电阻;阻值:10kΩ;精度:±1%;功率:62.5mW;最大工作电压:50V;温度系数:±100ppm/℃;; LCSC Part Name: 10kΩ ±1% 62.5mW 厚膜电阻; Supplier Part: C25744; Manufacturer: UNI-ROYAL(厚声); Supplier Footprint: 0402; JLCPCB Part Class: Basic Part; Datasheet: https://atta.szlcsc.com/upload/public/pdf/source/20200306/C422600_1E6D84923E4A46A82E41ADD87F860B5C.pdf; Supplier: LCSC; Type: 厚膜电阻; Tolerance: ±1%; Power(Watts): 62.5mW; Overload Voltage (Max): 50V; Temperature Coefficient: ±100ppm/℃; Operating Temperature Range: -55℃~+155℃
SW1-SW3 = TS-1087B-B3D2: 电路结构:单刀单掷;按钮形状:矩形按钮;作用力:250gf;安装方式:-;开关高度:3.5mm;带灯:-;机械寿命:-;; LCSC Part Name: 轻触开关7.0*2.3*3.5有柱黑柄侧按侧贴250gf; Supplier Part: C498302; Manufacturer: Yuandi(元迪); Supplier Footprint: SMD-4P,2.3x7mm; JLCPCB Part Class: 扩展库; Datasheet: https://atta.szlcsc.com/upload/public/pdf/source/20200318/C498302_5CF788D07D014771B0E800D7BCB3EFA7.pdf; Supplier: LCSC; Circuit: 单刀单掷; Actuator Style: 矩形按钮; Operating Force: 250gf; Switch Height: 3.5mm
TP1-TP6 = 测试点
U5 = STC8G1K08A-36I-DFN8: CPU内核:51系列;程序存储容量:8KB;GPIO端口数量:-;工作电压范围:-;CPU最大主频:-;程序存储器类型:FLASH;; Supplier Part: C915664; Manufacturer: STC(宏晶); Supplier Footprint: DFN-8-EP(3x3); JLCPCB Part Class: 扩展库; Datasheet: https://atta.szlcsc.com/upload/public/pdf/source/20230914/7707908C45C6343AE73767C1466DDB8D.pdf; Supplier: LCSC; CPU Core: 51系列; Program Storage Size: 8KB; Program Memory Type: FLASH; Internal Oscillator: 有
U6 = SIQ-02FVS3: LCSC Part Name: 拨轮滚轮旋转编码器开关; Supplier Part: C2925423; Manufacturer: MITSUMI(美上美); Supplier Footprint: SMD; JLCPCB Part Class: 扩展库; Datasheet: https://atta.szlcsc.com/upload/public/pdf/source/20220728/2FBC1A98A06DC86460FC69DAE20456FC.pdf; Supplier: LCSC
BAT1 = CAP_0805: Supplier Footprint: 0805; Check: false
C22 C31 = CL05A105KA5NQNC: 容值:1uF;精度:±10%;额定电压:25V;材质(温度系数):X5R;; LCSC Part Name: 1uF ±10% 25V; Supplier Part: C52923; Manufacturer: SAMSUNG(三星); Supplier Footprint: 0402; JLCPCB Part Class: Basic Part; Datasheet: https://atta.szlcsc.com/upload/public/pdf/source/20160218/1457707763339.pdf; Supplier: LCSC; Tolerance: ±10%; Voltage Rated: 25V; Temperature Coefficient: X5R
D1 D6 = SS34-MS: 二极管配置:-;正向压降(Vf):550mV@3A;直流反向耐压(Vr):40V;平均整流电流(Io):3A;; LCSC Part Name: 电压:40V 电流:3A; Supplier Part: C2836396; Manufacturer: MSKSEMI(美森科); Supplier Footprint: SMA(DO-214AC); Datasheet: https://atta.szlcsc.com/upload/public/pdf/source/20231010/B8429D209A8A83BAE11971393C9E7848.pdf; Supplier: LCSC; Forward Voltage (Vf@If): 550mV@3A; Reverse Voltage (Vr): 40V; Average Rectified Current (Io): 3A; Reverse Leakage Current (Ir): 500uA@40V
L1-L3 = FHD252012S-2R2MT: 电感值:2.2uH;精度:±20%;额定电流:2.15A;饱和电流(Isat):3A;; LCSC Part Name: 2.2uH ±20% 3A; Supplier Part: C602014; Manufacturer: cjiang(长江微电); Supplier Footprint: 1008; JLCPCB Part Class: 扩展库; Datasheet: https://atta.szlcsc.com/upload/public/pdf/source/20200609/C601990_BCEA243EC4DA0A9A288AA78A6DFB48A5.pdf; Supplier: LCSC; Tolerance: ±20%; Rated Current: 2.15A; DC Resistance (DCR): 100mΩ; Saturation Current (Isat): 3A
Q1 = SI2301CDS-T1-GE3: 类型:P沟道;漏源电压(Vdss):20V;连续漏极电流(Id):3.1A;功率(Pd):860mW；1.6W;导通电阻(RDS(on)@Vgs,Id):112mΩ@4.5V,2.8A;; LCSC Part Name: P沟道 20V 3.1A; Supplier Part: C10487; Manufacturer: VISHAY(威世); Supplier Footprint: SOT-23; JLCPCB Part Class: Basic Part; Datasheet: https://atta.szlcsc.com/upload/public/pdf/source/20180621/C10487_757133A2CC00440C4C7DD3E7E73681E9.pdf; Supplier: LCSC; Type: P沟道; Drain Source Voltage (Vdss): 20V; Continuous Drain Current (Id): 3.1A; Power Dissipation (Pd): 860mW；1.6W; Drain Source On Resistance (RDS(on)@Vgs,Id): 112mΩ@4.5V,2.8A; Gate Threshold Voltage (Vgs(th)@Id): 1V@250uA; Total Gate Charge (Qg@Vgs): 10nC@4.5V; Input Capacitance (Ciss@Vds): 405pF@10V; Operating Temperature: -55℃~+150℃@(Tj)
Q3 = AO3402: 类型:1个N沟道;漏源电压(Vdss):30V;连续漏极电流(Id):4A;功率(Pd):1.4W;导通电阻(RDS(on)@Vgs,Id):55mΩ@10V,4A;阈值电压(Vgs(th)@Id):1.4V@250uA;; LCSC Part Name: 1个N沟道 耐压:30V 电流:4A; Supplier Part: C14385; Manufacturer: AOS; Supplier Footprint: SOT-23; JLCPCB Part Class: 扩展库; Datasheet: https://atta.szlcsc.com/upload/public/pdf/source/20171023/C14385_15087455190191052858.pdf; Supplier: LCSC; Type: 1个N沟道; Drain Source Voltage (Vdss): 30V; Continuous Drain Current (Id): 4A; Power Dissipation (Pd): 1.4W; Drain Source On Resistance (RDS(on)@Vgs,Id): 55mΩ@10V,4A; Gate Threshold Voltage (Vgs(th)@Id): 1.4V@250uA; Total Gate Charge (Qg@Vgs): 4.34nC@4.5V; Input Capacitance (Ciss@Vds): 390pF@15V; Operating Temperature: -55℃~+150℃@(Tj)
R4 R5 R9 R10 = 0402WGF1003TCE: 电阻类型:厚膜电阻;阻值:100kΩ;精度:±1%;功率:62.5mW;最大工作电压:50V;温度系数:±100ppm/℃;; LCSC Part Name: 100kΩ ±1% 62.5mW 厚膜电阻; Supplier Part: C25741; Manufacturer: UNI-ROYAL(厚声); Supplier Footprint: 0402; JLCPCB Part Class: Basic Part; Datasheet: https://atta.szlcsc.com/upload/public/pdf/source/20200306/C422600_1E6D84923E4A46A82E41ADD87F860B5C.pdf; Supplier: LCSC; Type: 厚膜电阻; Tolerance: ±1%; Power(Watts): 62.5mW; Overload Voltage (Max): 50V; Temperature Coefficient: ±100ppm/℃; Operating Temperature Range: -55℃~+155℃
R6 = 0603WAF1003T5E: 电阻类型:厚膜电阻;阻值:100kΩ;精度:±1%;功率:100mW;最大工作电压:75V;温度系数:±100ppm/℃;; LCSC Part Name: 100kΩ ±1% 100mW 厚膜电阻; Supplier Part: C25803; Manufacturer: UNI-ROYAL(厚声); Supplier Footprint: 0603; JLCPCB Part Class: Basic Part; Datasheet: https://atta.szlcsc.com/upload/public/pdf/source/20200306/C422600_1E6D84923E4A46A82E41ADD87F860B5C.pdf; Supplier: LCSC; Type: 厚膜电阻; Tolerance: ±1%; Power(Watts): 100mW; Temperature Coefficient: ±100ppm/℃; Overload Voltage (Max): 75V; Operating Temperature Range: -55℃~+155℃
R7 = 0402WGF1503TCE: 电阻类型:厚膜电阻;阻值:150kΩ;精度:±1%;功率:62.5mW;最大工作电压:50V;温度系数:±100ppm/℃;; LCSC Part Name: 150kΩ ±1% 62.5mW 厚膜电阻; Supplier Part: C25755; Manufacturer: UNI-ROYAL(厚声); Supplier Footprint: 0402; JLCPCB Part Class: Extended Part; Datasheet: https://atta.szlcsc.com/upload/public/pdf/source/20200306/C422600_1E6D84923E4A46A82E41ADD87F860B5C.pdf; Supplier: LCSC; Type: 厚膜电阻; Tolerance: ±1%; Power(Watts): 62.5mW; Overload Voltage (Max): 50V; Temperature Coefficient: ±100ppm/℃; Operating Temperature Range: -55℃~+155℃
R8 = 0402WGF6802TCE: 电阻类型:厚膜电阻;阻值:68kΩ;精度:±1%;功率:62.5mW;最大工作电压:50V;温度系数:±100ppm/℃;; LCSC Part Name: 68kΩ ±1% 62.5mW 厚膜电阻; Supplier Part: C36871; Manufacturer: UNI-ROYAL(厚声); Supplier Footprint: 0402; JLCPCB Part Class: Extended Part; Datasheet: https://atta.szlcsc.com/upload/public/pdf/source/20200306/C422600_1E6D84923E4A46A82E41ADD87F860B5C.pdf; Supplier: LCSC; Type: 厚膜电阻; Tolerance: ±1%; Power(Watts): 62.5mW; Overload Voltage (Max): 50V; Temperature Coefficient: ±100ppm/℃; Operating Temperature Range: -55℃~+155℃
R11 = 0402WGF1502TCE: 电阻类型:厚膜电阻;阻值:15kΩ;精度:±1%;功率:62.5mW;最大工作电压:50V;温度系数:±100ppm/℃;; LCSC Part Name: 15kΩ ±1% 62.5mW 厚膜电阻; Supplier Part: C25756; Manufacturer: UNI-ROYAL(厚声); Supplier Footprint: 0402; JLCPCB Part Class: Basic Part; Datasheet: https://atta.szlcsc.com/upload/public/pdf/source/20200306/C422600_1E6D84923E4A46A82E41ADD87F860B5C.pdf; Supplier: LCSC; Type: 厚膜电阻; Tolerance: ±1%; Power(Watts): 62.5mW; Overload Voltage (Max): 50V; Temperature Coefficient: ±100ppm/℃; Operating Temperature Range: -55℃~+155℃
R12 = 0402WGF2003TCE: 电阻类型:厚膜电阻;阻值:200kΩ;精度:±1%;功率:62.5mW;最大工作电压:50V;温度系数:±100ppm/℃;; LCSC Part Name: 200kΩ ±1% 62.5mW 厚膜电阻; Supplier Part: C25764; Manufacturer: UNI-ROYAL(厚声); Supplier Footprint: 0402; JLCPCB Part Class: Basic Part; Datasheet: https://atta.szlcsc.com/upload/public/pdf/source/20200306/C422600_1E6D84923E4A46A82E41ADD87F860B5C.pdf; Supplier: LCSC; Type: 厚膜电阻; Tolerance: ±1%; Power(Watts): 62.5mW; Overload Voltage (Max): 50V; Temperature Coefficient: ±100ppm/℃; Operating Temperature Range: -55℃~+155℃
R30 = 0603WAF2201T5E: 电阻类型:厚膜电阻;阻值:2.2kΩ;精度:±1%;功率:100mW;最大工作电压:75V;温度系数:±100ppm/℃;; LCSC Part Name: 2.2kΩ ±1% 100mW 厚膜电阻; Supplier Part: C4190; Manufacturer: UNI-ROYAL(厚声); Supplier Footprint: 0603; JLCPCB Part Class: Basic Part; Datasheet: https://atta.szlcsc.com/upload/public/pdf/source/20200306/C422600_1E6D84923E4A46A82E41ADD87F860B5C.pdf; Supplier: LCSC; Type: 厚膜电阻; Tolerance: ±1%; Power(Watts): 100mW; Overload Voltage (Max): 75V; Temperature Coefficient: ±100ppm/℃; Operating Temperature Range: -55℃~+155℃
U2 = EA3036QDR: 三路电源管理芯片，应用于直流5V供电或单节锂电池应用; LCSC Part Name: 停产; Supplier Part: C111587; Manufacturer: everanalog(申风); Supplier Footprint: QFN-20-EP(3x3); JLCPCB Part Class: 扩展库; Datasheet: https://atta.szlcsc.com/upload/public/pdf/source/20170522/1495423585182.pdf; Supplier: LCSC
U7 = LTH7: LCSC Part Name: LTH7 停产; Supplier Part: C394632; Manufacturer: FM(富满); Supplier Footprint: SOT-23-5; JLCPCB Part Class: 扩展库; Datasheet: https://atta.szlcsc.com/upload/public/pdf/source/20190523/C394632_B904BC8C11CB656429A68E094E3EE357.pdf; Supplier: LCSC
C1 C2 C4 C5 = 0402CG120J500NT: 容值:12pF;精度:±5%;额定电压:50V;材质(温度系数):C0G;; LCSC Part Name: 12pF ±5% 50V; Supplier Part: C1547; Manufacturer: FH(风华); Supplier Footprint: 0402; JLCPCB Part Class: Basic Part; Datasheet: https://atta.szlcsc.com/upload/public/pdf/source/20200305/C486355_26A10D38EF8C2A5C37091D0039909270.pdf; Supplier: LCSC; Tolerance: ±5%; Voltage Rated: 50V; Temperature Coefficient: C0G
C3 = CL05A106MQ5NUNC: 容值:10uF;精度:±20%;额定电压:6.3V;材质(温度系数):X5R;; LCSC Part Name: 10uF ±20% 6.3V; Supplier Part: C15525; Manufacturer: SAMSUNG(三星); Supplier Footprint: 0402; JLCPCB Part Class: Basic Part; Datasheet: https://atta.szlcsc.com/upload/public/pdf/source/20220823/2B02EE04F8F211D38A52DCB16EB6BEBA.pdf; Supplier: LCSC; Tolerance: ±20%; Voltage Rated: 6.3V; Temperature Coefficient: X5R
C6 = CL10A225KO8NNNC: 容值:2.2uF;精度:±10%;额定电压:16V;材质(温度系数):X5R;; LCSC Part Name: 2.2uF ±10% 16V; Supplier Part: C23630; Manufacturer: SAMSUNG(三星); Supplier Footprint: 0603; JLCPCB Part Class: Basic Part; Datasheet: https://atta.szlcsc.com/upload/public/pdf/source/20160218/1457707763339.pdf; Supplier: LCSC; Tolerance: ±10%; Voltage Rated: 16V; Temperature Coefficient: X5R
C7 C9 C10 C24 = CL10A106KP8NNNC: 容值:10uF;精度:±10%;额定电压:10V;材质(温度系数):X5R;; LCSC Part Name: 10uF ±10% 10V; Supplier Part: C19702; Manufacturer: SAMSUNG(三星); Supplier Footprint: 0603; JLCPCB Part Class: Basic Part; Datasheet: https://atta.szlcsc.com/upload/public/pdf/source/20160103/1457707703378.pdf; Supplier: LCSC; Tolerance: ±10%; Voltage Rated: 10V; Temperature Coefficient: X5R
C8 = CL10B474KA8NNNC: 容值:470nF;精度:±10%;额定电压:25V;材质(温度系数):X7R;; LCSC Part Name: 470nF ±10% 25V; Supplier Part: C1623; Manufacturer: SAMSUNG(三星); Supplier Footprint: 0603; JLCPCB Part Class: 基础库; Datasheet: https://atta.szlcsc.com/upload/public/pdf/source/20160218/1457707763339.pdf; Supplier: LCSC; Tolerance: ±10%; Voltage Rated: 25V; Temperature Coefficient: X7R
R2 = RMC04025.1M1%N: 阻值:5.1MΩ;精度:±1%;功率:62.5mW;; LCSC Part Name: 5.1MΩ ±1% 62.5mW; Supplier Part: C269650; Manufacturer: Tyohm(幸亚电阻); Supplier Footprint: 0402; JLCPCB Part Class: Extended Part; Datasheet: https://atta.szlcsc.com/upload/public/pdf/source/20190115/C325956_D27151D492FFB3C9AB4A6F14FE01F30A.pdf; Supplier: LCSC; Tolerance: ±1%; Power(Watts): 62.5mW
R3 = 0603WAF2400T5E: 阻值:240Ω;精度:±1%;功率:100mW;温度系数:±100ppm/℃;电阻类型:厚膜电阻;; LCSC Part Name: 240Ω ±1% 100mW 厚膜电阻; Supplier Part: C23350; Manufacturer: UNI-ROYAL(厚声); Supplier Footprint: 0603; JLCPCB Part Class: 扩展库; Datasheet: https://atta.szlcsc.com/upload/public/pdf/source/20200306/C422600_1E6D84923E4A46A82E41ADD87F860B5C.pdf; Supplier: LCSC; Tolerance: ±1%; Power(Watts): 100mW; Overload Voltage (Max): 75V; Temperature Coefficient: ±100ppm/℃; Type: 厚膜电阻; Operating Temperature Range: -55℃~+155℃
U1 = T113-S3_C5197687: A SoC designed by Allwinner, CPU Arm A7 *2@1200MHz+, sip 128M DDR, rich audio and video interfaces, especially good at display; LCSC Part Name: Allwinner T113-S3; Supplier Part: C5197687; Manufacturer: Allwinner(全志); Supplier Footprint: ELQFP-128; JLCPCB Part Class: 扩展库; Datasheet: https://atta.szlcsc.com/upload/public/pdf/source/20230418/C7B258905E15D9A051FB3C15559073B6.pdf; Supplier: LCSC
X1 = XL2EL89COI-111YLC-24M: 频率： 24MHZ 负载： 12PF 频率公差： ±10PPM 工作温度： -40~85℃; LCSC Part Name: 24MHZ 12PF ±10PPM YSX321SL; Supplier Part: C5444545; Manufacturer: YXC(扬兴晶振); Supplier Footprint: SMD3225-4P; JLCPCB Part Class: Extended Part; Datasheet: https://atta.szlcsc.com/upload/public/pdf/source/20230822/747CCFB439F2D13D53454752F2993171.pdf; Supplier: LCSC
X2 = X321532768KGD2SI: 晶振类型:贴片晶振;频率:32.768kHz;常温频差:±20ppm;外接负载电容:12.5pF;; LCSC Part Name: 32.768kHz ±20ppm 12.5pF; Supplier Part: C620155; Manufacturer: YXC(扬兴晶振); Supplier Footprint: SMD3215-2P; JLCPCB Part Class: Extended Part; Datasheet: https://atta.szlcsc.com/upload/public/pdf/source/20210329/C620155_E5A74FC0D27C5E9015A8D75DE9484FEA.pdf; Supplier: LCSC; Crystal Type: 贴片晶振; Normal temperature Frequency Tolerance: ±20ppm; External load capacitor: 12.5pF; Operating Temperature: -40℃~+85℃
CARD1 = TF-018: 卡连接方式:拔插式;卡类型:MicroSD卡(TF卡);连接器类型:卡座;本体最大高度:1.5mm;触头镀层:镀金;工作温度范围:-25℃~+85℃;; LCSC Part Name: 拔插式 MicroSD卡(TF卡) 卡座 短卡座9P中间边上带侦测; Supplier Part: C961679; Manufacturer: HANBO(汉博); Supplier Footprint: SMD; JLCPCB Part Class: 扩展库; Datasheet: https://atta.szlcsc.com/upload/public/pdf/source/20221111/2928BC23ED293CD708B2624B434E0C57.pdf; Supplier: LCSC; Card Connection Mode: 拔插式; Card Type: MicroSD卡(TF卡); Connector Type: 卡座; Maximum Body Height: 1.5mm; Contact Plating: 镀金; Operating Temperature Range: -25℃~+85℃
R20 R22 = 0402WGF5101TCE: 电阻类型:厚膜电阻;阻值:5.1kΩ;精度:±1%;功率:62.5mW;最大工作电压:50V;温度系数:±100ppm/℃;; LCSC Part Name: 5.1kΩ ±1% 62.5mW 厚膜电阻; Supplier Part: C25905; Manufacturer: UNI-ROYAL(厚声); Supplier Footprint: 0402; JLCPCB Part Class: Basic Part; Datasheet: https://atta.szlcsc.com/upload/public/pdf/source/20200306/C422600_1E6D84923E4A46A82E41ADD87F860B5C.pdf; Supplier: LCSC; Type: 厚膜电阻; Tolerance: ±1%; Power(Watts): 62.5mW; Overload Voltage (Max): 50V; Temperature Coefficient: ±100ppm/℃; Operating Temperature Range: -55℃~+155℃
USB1 = TYPE-C 16PIN 2MD(073): 连接器类型:Type-C;标准:-;公母:母;端口数量:1;触点数量:16P;安装方式:卧贴;额定电流 - 电源:5A;工作温度范围:-25℃~+85℃;; LCSC Part Name: Type-C 母 卧贴; Supplier Part: C2765186; Manufacturer: SHOU HAN(首韩); Supplier Footprint: SMD; JLCPCB Part Class: 扩展库; Datasheet: https://atta.szlcsc.com/upload/public/pdf/source/20211123/39B17C16241EAC15C5E277BDA434118E.pdf; Supplier: LCSC; Connector Type: Type-C; Gender: 母; Number of Ports: 1; Number of Contacts: 16P; Mounting Style: 卧贴; Current Rating - Power (Max): 5A; Operating Temperature Range: -25℃~+85℃

## Nets
0V9: C24.2 C25.2 C26.2 C27.2 C28.2 C37.2 C38.2 L3.1 R9.2 U1.46(VDD-SYS0) U1.51(VDD-SYS1) U1.81(VDD-SYS2) U1.116(VDD-CORE0) U1.117(VDD-CORE1)
1V5: C10.2 C11.2 C33.2 C34.2 L1.1 R7.2 U1.48(VCC-DRAM0) U1.49(VCC-DRAM1)
3V3: C17.2 C18.2 C19.2 C22.2 C23.2 C35.2 C36.2 C39.2 C40.2 CARD1.4(VDD) FPC2.8 FPC2.9 FPC2.30 FPC2.37 FPC2.38 FPC2.39 L2.1 Q2.2(S) R1.2 R4.2 R8.2 R13.2 U1.29(LDO-IN) U1.34(VCC-PE) U1.66(VCC-PD) U1.83(VCC-IO) U1.128(VCC-PG)
+5V: D1.2(K) D6.2(K) Q1.1(G) R6.1 USB1.2(VBUS) USB1.11(VBUS)
AVCC: C6.2 U1.89(AVCC)
GND: BAT1.2 C1.2 C2.2 C3.1 C4.2 C5.2 C6.1 C7.1 C8.1 C9.1 C10.1 C11.1 C12.1 C15.1 C16.1 C17.1 C18.1 C19.1 C20.1 C21.1 C22.1 C23.1 C24.1 C25.1 C26.1 C27.1 C28.1 C29.1 C30.1 C31.1 C32.1 C33.1 C35.1 C37.1 C39.1 C40.1 C43.1 CARD1.6(VSS) CARD1.10(SHELL) FPC2.1 FPC2.3 FPC2.4 FPC2.5 FPC2.6 FPC2.7 FPC2.10 FPC2.29 FPC2.33 FPC2.36 FPC2.40 FPC2.41 Q3.2(S) R3.1 R5.1 R6.2 R10.1 R11.1 R12.1 R20.2 R22.2 R30.1 SW1.2 SW1.3 SW1.4 SW2.2 SW2.3 SW2.4 SW3.2 SW3.3 SW3.4 U1.91(AGND) U1.129(EPAD) U2.1(GND3) U2.4(GND2) U2.5(GND2) U2.12(GND1) U2.13(GND1) U2.15(AGND) U2.17(AGND) U2.21(EP) U5.4(Gnd/AGnd) U5.9(EP) U6.1(EH) U6.2(EH) U6.3(EH) U6.4(EH) U6.5(EH) U6.6(EH) U6.C U7.2(GND) USB1.1(GND) USB1.12(GND) USB1.13(SHELL) USB1.14(SHELL) X1.2(GND) X1.4(GND)
VBAT: BAT1.1 Q1.3(D) U7.3(BAT)
VCC_PMU: C29.2 C30.2 C31.2 C43.2 D1.1(A) Q1.2(S) R31.2 TP3.1 U2.7(VIN2) U2.10(VIN1) U2.16(VCC) U2.19(VIN3) U5.2(Vcc/AVcc)
BATT_CHRG_MCU: U5.1(INT2/ADC4/P5.4) U7.1(CHRG)
CAM_GND: Q3.3(D) TP6.1
DXIN: C1.1 U1.23(DXIN) X1.1
DXOUT: C2.1 U1.22(DXOUT) X1.3
DZQ: R3.2 U1.47(DZQ)
EN1: Q3.1(G) R5.2 U2.8(EN2) U2.9(EN1) U5.8(P3.3/ADC3/TxD_2)
EN3: C32.2 R4.1 U2.18(EN3)
FB1: C34.1 R7.1 R10.2 U2.14(FB1)
FB2: C36.1 R8.1 R11.2 U2.3(FB2)
FB3: C38.1 R9.1 R12.2 U2.2(FB3)
GPADC: U1.101(GPADC0)
HPOUTFB: U1.100(HPOUTFB)
HPOUTL: U1.99(HPOUTL)
HPOUTR: U1.98(HPOUTR)
HPVCC: C9.2 U1.97(HPVCC)
KEY_MCU: D5.2(A) R31.1 U5.7(P3.2/ADC2/RxD_2)
KEY_SOC: D4.2(A) U1.126(PG14)
KEY_SW: D4.1(K) D5.1(K) SW1.1
LCD_BL: FPC2.2 Q2.3(D)
LCD_DB0: FPC2.11 U1.55(PD0)
LCD_DB1: FPC2.12 U1.56(PD1)
LCD_DB2: FPC2.13 U1.57(PD2)
LCD_DB3: FPC2.14 U1.58(PD3)
LCD_DB4: FPC2.15 U1.59(PD4)
LCD_DB5: FPC2.16 U1.60(PD5)
LCD_DB6: FPC2.17 U1.61(PD6)
LCD_DB7: FPC2.18 U1.62(PD7)
LCD_DB8: FPC2.19 U1.63(PD8)
LCD_DB9: FPC2.20 U1.64(PD9)
LCD_DB10: FPC2.21 U1.67(PD10)
LCD_DB11: FPC2.22 U1.68(PD11)
LCD_DB12: FPC2.23 U1.70(PD12)
LCD_DB13: FPC2.24 U1.69(PD13)
LCD_DB14: FPC2.25 U1.71(PD14)
LCD_DB15: FPC2.26 U1.72(PD15)
LCD_DB16: FPC2.27 U1.73(PD16)
LCD_DB17: FPC2.28 U1.74(PD17)
LCD_RESET: FPC2.35 U1.52(PD22)
LCD_RS: FPC2.32 U1.76(PD19)
LCD_TE: FPC2.34 U1.53(PD21)
LCD_WR: FPC2.31 U1.75(PD18)
LDOA_OUT: C12.2 C16.2 C20.2 C21.2 U1.20(VCC-PLL) U1.26(VCC-RTC) U1.28(LDOA-OUT) U1.50(VDD18-DRAM) U1.65(VCC-LVDS)
LDOB_OUT: C15.2 U1.30(LDOB-OUT)
LX1: L1.2 U2.11(LX1)
LX2: L2.2 U2.6(LX2)
LX3: L3.2 U2.20(LX3)
MCU_RX: R29.1 TP2.1 U5.5(P3.0/ADC0/RxD)
MCU_TX: R28.1 TP1.1 U5.6(P3.1/ADC1/TxD)
MIC3N: U1.88(MICIN3N)
MIC3P: U1.87(MICIN3P)
OUT_RX: U1.125(PG13) USB1.3(SBU2)
OUT_TX: U1.124(PG12) USB1.9(SBU1)
PB2: U1.86(PB2)
PB3: U1.85(PB3)
PB4: U1.84(PB4)
PB5: U1.82(PB5)
PB6: U1.80(PB6)
PB7: U1.79(PB7)
PC2: U1.19(PC2)
PC3: U1.18(PC3)
PC4: U1.17(PC4)
PC5: U1.16(PC5)
PC6: U1.15(PC6)
PC7: U1.14(PC7)
PD20: Q2.1(G) R13.1 U1.54(PD20)
PE0: U1.44(PE0)
PE1: U1.45(PE1)
PE2: U1.35(PE2)
PE3: U1.33(PE3) U6.A
PE4: U1.43(PE4)
PE5: U1.42(PE5)
PE6: U1.41(PE6)
PE7: U1.40(PE7)
PE8: U1.39(PE8)
PE9: U1.38(PE9)
PE10: U1.37(PE10)
PE11: U1.36(PE11)
PE12: U1.32(PE12) U6.B
PE13: U1.31(PE13) U6.S
PF0: CARD1.8(DAT1) U1.7(PF0)
PF1: CARD1.7(DAT0) U1.8(PF1)
PF2: CARD1.5(CLK) U1.9(PF2)
PF3: CARD1.3(CMD) U1.10(PF3)
PF4: CARD1.2(CD/DAT3) U1.11(PF4)
PF5: CARD1.1(DAT2) U1.12(PF5)
PF6: U1.13(PF6)
PG0: U1.120(PG0)
PG1: U1.118(PG1)
PG2: U1.119(PG2)
PG3: U1.121(PG3)
PG4: U1.123(PG4)
PG5: U1.122(PG5)
PG6: U1.1(PG6)
PG7: U1.2(PG7)
PG8: R29.2 U1.3(PG8)
PG9: R28.2 U1.4(PG9)
PG10: SW2.1 U1.5(PG10)
PG11: SW3.1 U1.6(PG11)
PG15: U1.127(PG15)
RESET: C3.2 R1.1 U1.27(RESET)
USB0_DM: U1.114(USB0-DM) USB1.5(DN2) USB1.7(DN1)
USB0_DP: U1.115(USB0-DP) USB1.6(DP1) USB1.8(DP2)
USB1_DM: TP4.1 U1.113(USB1-DM)
USB1_DP: TP5.1 U1.112(USB1-DP)
VRA1: C7.2 U1.92(VRA1)
VRA2: C8.2 U1.90(VRA2)
X32KIN: C4.1 R2.2 U1.25(X32KIN) X2.2
X32KOUT: C5.1 R2.1 U1.24(X32KOUT) X2.1
$2N8937: D6.1(A) U7.4(VCC)
$2N8946: R30.2 U7.5(PROG)
$5N1906: R20.1 USB1.10(CC2)
$5N1912: R22.1 USB1.4(CC1)

Not connected (* = marked no-connect by the designer): CARD1 9(SWITCH)*; U1 21(REFCLK-OUT)* 77(VCC-TVOUT)* 78(TVOUT0)* 93(FMINR)* 94(FMINL)* 95(LINEINR)* 96(LINEINL)* 102(TP-X1)* 103(TP-X2)* 104(TP-Y1)* 105(TP-Y2)* 106(NC0)* 107(VCC-TVIN)* 108(TVIN0)* 109(TVIN1)* 110(TVIN-VRP)* 111(TVIN-VRN)*; U5 3(INT3/ADC5/P5.5)*

## Notes on the sheets
sheet 1
- DCXO-SYS
- RESET
- OSC_32K
- Powered by
  internal HPLDO
- Powered byinternal ALDO
- Use 1% resistance
- 3.3V
- 1.8V
- 0.9V
- 1.5V(T113-S3 DDR3)/1.8V(D1S DDR2)
sheet 2
- 10ms For 2ms
  Power-On Timing
- VOUT=0.6x(R1/R2)+0.6
- 电源切换电路
- 3V3
  1V5
  0V9
- PMU
sheet 4
- TF Card
sheet 6
- 防止单片机进入下载模式
